# EAGLE schematic STM32-PROX (EAGLE 6.5.0)

## Sheet 1 of 8
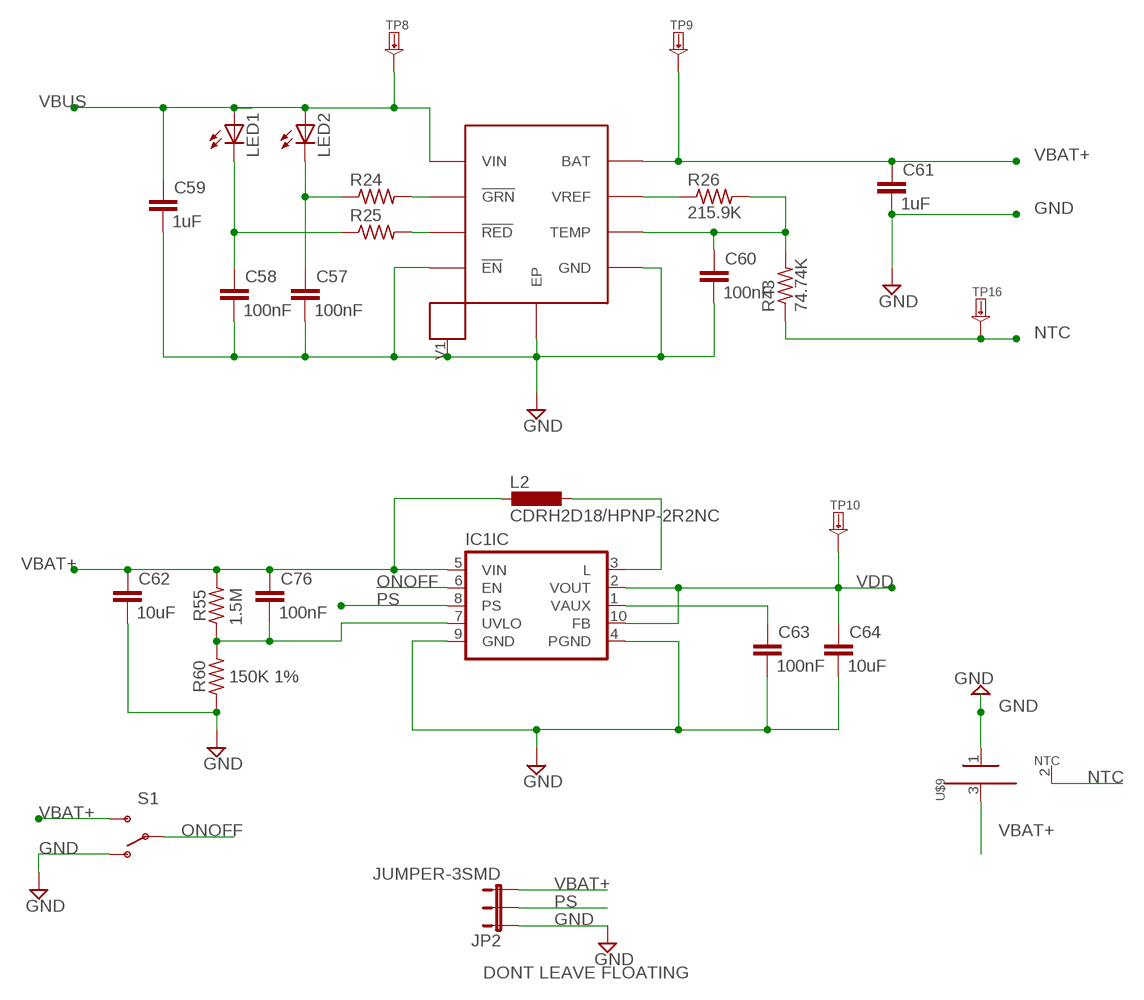
[diagram p0: schematic, sheet 1]

### Parts
C57  100nF  CAPACITORRLC_0603  [RLC_0603]
C58  100nF  CAPACITORRLC_0603  [RLC_0603]
C59  1uF  CAPACITORRLC_0603  [RLC_0603]
C60  100nF  CAPACITORRLC_0603  [RLC_0603]
C61  1uF  CAPACITORRLC_0603  [RLC_0603]
C62  10uF  CAPACITORRLC_0603  [RLC_0603]
C63  100nF  CAPACITORRLC_0603  [RLC_0603]
C64  10uF  CAPACITORRLC_0603  [RLC_0603]
C76  100nF  CAPACITORRLC_0603  [RLC_0603]
IC1  IC_TPS6120XQFN10  [QFN-10]
JP2  JUMPER-3SMD  [SJ_3]
L2  CDRH2D18/HPNP-2R2NC  CDRH2D18  [CDRH2D18]
LED1  LED_LEDSML0603  [LED_SML0603]
LED2  LED_LEDSML0603  [LED_SML0603]
R24  RESISTORRLC_0603  [RLC_0603@1]
R25  RESISTORRLC_0603  [RLC_0603@1]
R26  215.9K  RESISTORRLC_0603  [RLC_0603@1]
R43  74.74K  RESISTORRLC_0603  [RLC_0603@1]
R55  1.5M  RESISTORRLC_0603  [RLC_0603@1]
R60  150K 1%  RESISTORRLC_0603  [RLC_0603@1]
S1  SWITCH-SPDT-SMD-A  [SWITCH-SPST-SMD-A]
TP8  TESTPAD0.7MM-ROUND-DRILLED  [TESTPAD-PTH-0.7MM]
TP9  TESTPADKEYSTONE-SMD  --MERGED_TESTPADKEYSTONE-SMD  [--MERGED_KEYSTONE-SMD-TESTPOINT-5015]
TP10  TESTPADKEYSTONE-SMD  --MERGED_TESTPADKEYSTONE-SMD  [--MERGED_KEYSTONE-SMD-TESTPOINT-5015]
TP16  TESTPAD  [SMD-TESTPOINT]
U$7  MC34674  [UDFN-EP]
U$9  BATT  [BATT]

### Nets
GND [power]: C57.2 C58.2 C59.2 C60.2 C61.2 C62.2 C63.2 C64.2 IC1.4(IC:PGND) IC1.9(IC:GND) JP2.1 R60.1 S1.1(O) U$7.4(!EN) U$7.5(GND) U$7.9(EP) U$7.V1 U$9.1(NEG) ; also sheet 2,3,4,5,6,7,8
N$6: C57.1 LED2.C R24.1
N$8: R24.2 U$7.2(!GRN)
N$55: C58.1 LED1.C R25.1
N$63: R25.2 U$7.3(!RED)
N$64: R26.1 U$7.7(VREF)
N$65: C60.1 R26.2 R43.2 U$7.6(TEMP)
N$66: C63.1 IC1.1(IC:VAUX)
N$67: C76.2 IC1.7(IC:UVLO) R55.1 R60.2
N$68: IC1.3(IC:L) L2.P$2
NTC [power]: R43.1 TP16.1 U$9.2(NTC)
ONOFF: IC1.6(IC:EN) S1.2(P)
PS: IC1.8(IC:PS) JP2.2
VBAT+ [power]: C61.1 C62.1 C76.1 IC1.5(IC:VIN) JP2.3 L2.P$1 R55.2 S1.3(S) TP9.1 U$7.8(BAT) U$9.3(POS)
VBUS [power]: C59.1 LED1.A LED2.A TP8.1 U$7.1(VIN) ; also sheet 2
VDD [power]: C64.1 IC1.2(IC:VOUT) IC1.10(IC:FB) TP10.1 ; also sheet 2,4,5,6

### Notes on the sheet
- DONT LEAVE FLOATING

## Sheet 2 of 8
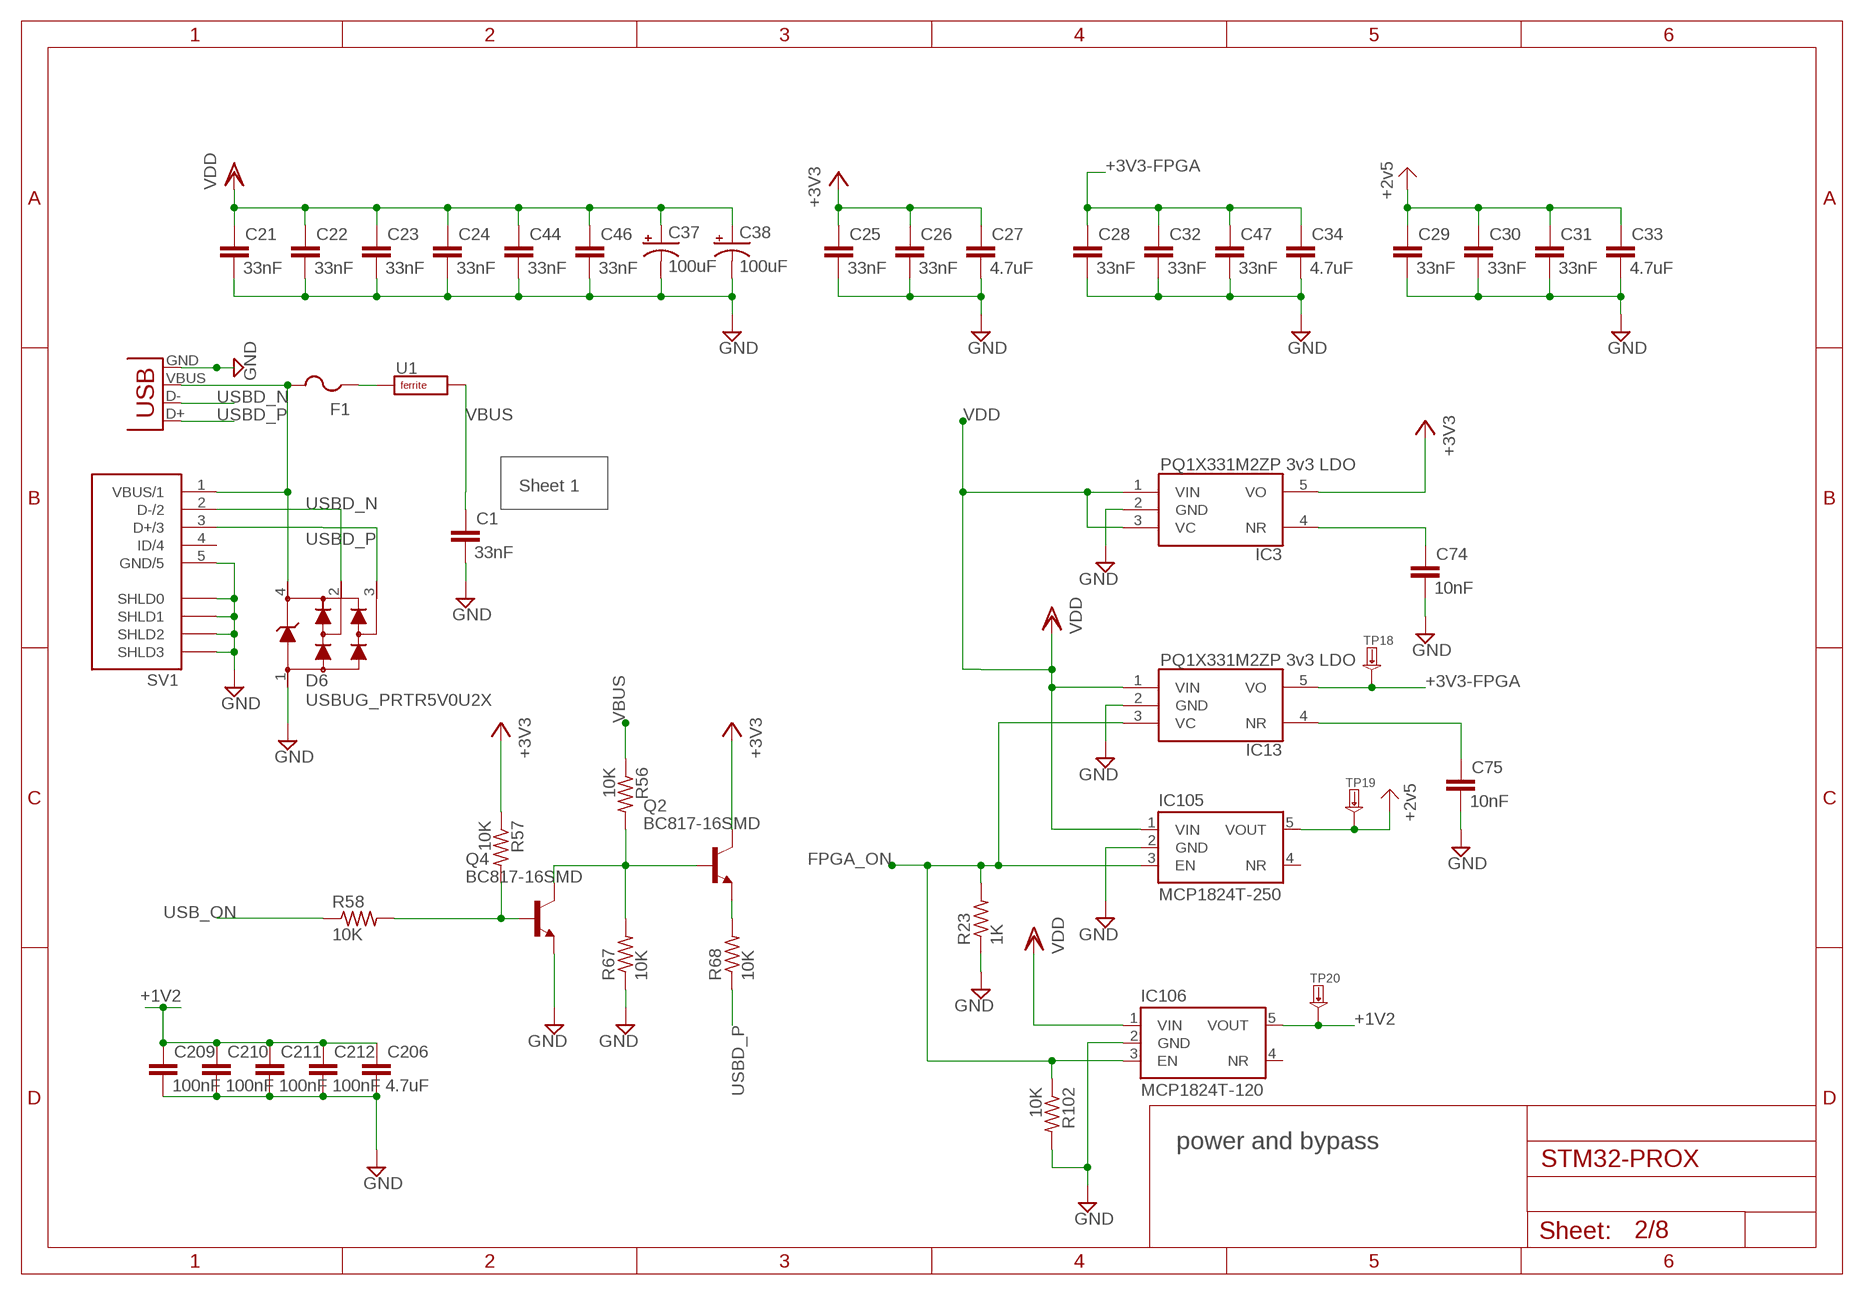
[diagram p1: schematic, sheet 2]

### Parts
C1  33nF  CAPACITORRLC_0603  [RLC_0603]
C21  33nF  CAPACITORRLC_0603  [RLC_0603]
C22  33nF  CAPACITORRLC_0603  [RLC_0603]
C23  33nF  CAPACITORRLC_0603  [RLC_0603]
C24  33nF  CAPACITORRLC_0603  [RLC_0603]
C25  33nF  CAPACITORRLC_0603  [RLC_0603]
C26  33nF  CAPACITORRLC_0603  [RLC_0603]
C27  4.7uF  CAPACITOR1210  [RLC_1210]
C28  33nF  CAPACITORRLC_0603  [RLC_0603]
C29  33nF  CAPACITORRLC_0603  [RLC_0603]
C30  33nF  CAPACITORRLC_0603  [RLC_0603]
C31  33nF  CAPACITORRLC_0603  [RLC_0603]
C32  33nF  CAPACITORRLC_0603  [RLC_0603]
C33  4.7uF  CAPACITOR1210  [RLC_1210]
C34  4.7uF  CAPACITOR1210  [RLC_1210]
C37  100uF  CPOL-USD/7343-31R  [D/7343-31R]
C38  100uF  CPOL-USD/7343-31R  [D/7343-31R]
C44  33nF  CAPACITORRLC_0603  [RLC_0603]
C46  33nF  CAPACITORRLC_0603  [RLC_0603]
C47  33nF  CAPACITORRLC_0603  [RLC_0603]
C74  10nF  CAPACITORRLC_0603  [RLC_0603]
C75  10nF  CAPACITORRLC_0603  [RLC_0603]
C206  4.7uF  CAPACITORRLC_0603  [RLC_0603]
C209  100nF  CAPACITORRLC_0603  [RLC_0603]
C210  100nF  CAPACITORRLC_0603  [RLC_0603]
C211  100nF  CAPACITORRLC_0603  [RLC_0603]
C212  100nF  CAPACITORRLC_0603  [RLC_0603]
D6  USBUG_PRTR5V0U2X  [USBUG_SOT143B]
F1  PTCFUSE-1812  [1812]
IC3  PQ1X331M2ZP-3V3-LDO-SOT-23-5  [SOT-23-5]
IC13  PQ1X331M2ZP-3V3-LDO-SOT-23-5  [SOT-23-5]
IC105  MCP1824T-250  TPS79925  [SOT-23-5]
IC106  MCP1824T-120  TPS79912  [SOT-23-5]
Q2  BC817-16SMD  [SOT23-BEC]
Q4  BC817-16SMD  [SOT23-BEC]
R23  1K  RESISTORRLC_0603  [RLC_0603@1]
R56  10K  RESISTORRLC_0603  [RLC_0603@1]
R57  10K  RESISTORRLC_0603  [RLC_0603@1]
R58  10K  RESISTORRLC_0603  [RLC_0603@1]
R67  10K  RESISTORRLC_0603  [RLC_0603@1]
R68  10K  RESISTORRLC_0603  [RLC_0603@1]
R102  10K  RESISTORRLC_0603  [RLC_0603@1]
SV1  USB-MINIB  [USB-MINIB-SMD]
TP18  TESTPAD  [SMD-TESTPOINT]
TP19  TESTPAD  [SMD-TESTPOINT]
TP20  TESTPAD  [SMD-TESTPOINT]
U1  FERRITE0805  [RLC_0805]
USB-MICRO  USB-MICROB  [USB-MICROB]

### Nets
+1V2 [power]: C206.1 C209.1 C210.1 C211.1 C212.1 IC106.5(VOUT) TP20.1 ; also sheet 4
+2V5 [power]: C29.1 C30.1 C31.1 C33.1 IC105.5(VOUT) TP19.1 ; supply symbol labelled SUPPLY_2V5 ; also sheet 4
+3V3 [power]: C25.1 C26.1 C27.1 IC3.5(VO) Q2.C R57.1 ; also sheet 3,4,7,8
+3V3-FPGA [power]: C28.1 C32.1 C34.1 C47.1 IC13.5(VO) TP18.1 ; also sheet 4
FPGA_ON: IC13.3(VC) IC105.3(EN) IC106.3(EN) R23.2 R102.1 ; also sheet 3
GND [power]: C1.2 C21.2 C22.2 C23.2 C24.2 C25.2 C26.2 C27.2 C28.2 C29.2 C30.2 C31.2 C32.2 C33.2 C34.2 C37.- C38.- C44.2 C46.2 C47.2 C74.2 C75.2 C206.2 C209.2 C210.2 C211.2 C212.2 D6.1 IC3.2(GND) IC13.2(GND) IC105.2(GND) IC106.2(GND) Q4.E R23.1 R67.1 R102.2 SV1.5(GND/5) SV1.TAB0(SHLD0) SV1.TAB1(SHLD1) SV1.TAB2(SHLD2) SV1.TAB3(SHLD3) USB-MICRO.GND ; also sheet 1,3,4,5,6,7,8
N$12 [power]: F1.1 U1.1(A)
N$46: C74.1 IC3.4(NR)
N$49: C75.1 IC13.4(NR)
N$70: Q2.E R68.2
N$71: Q4.B R57.2 R58.2
N$72: Q2.B Q4.C R56.2 R67.2
USB_ON: R58.1 ; also sheet 3
USBD_N: D6.2 SV1.2(D-/2) USB-MICRO.D- ; also sheet 3
USBD_P: D6.3 R68.1 SV1.3(D+/3) USB-MICRO.D+ ; also sheet 3
VBUS [power]: C1.1 R56.1 U1.2(B) ; also sheet 1
VBUS_IN [power]: D6.4 F1.2 SV1.1(VBUS/1) USB-MICRO.VBUS
VDD [power]: C21.1 C22.1 C23.1 C24.1 C37.+ C38.+ C44.1 C46.1 IC3.1(VIN) IC3.3(VC) IC13.1(VIN) IC105.1(VIN) IC106.1(VIN) ; also sheet 1,4,5,6
Unconnected: IC105.4(NR) IC106.4(NR) SV1.4(ID/4)

### Notes on the sheet
- Sheet 1
- power and bypass

## Sheet 3 of 8
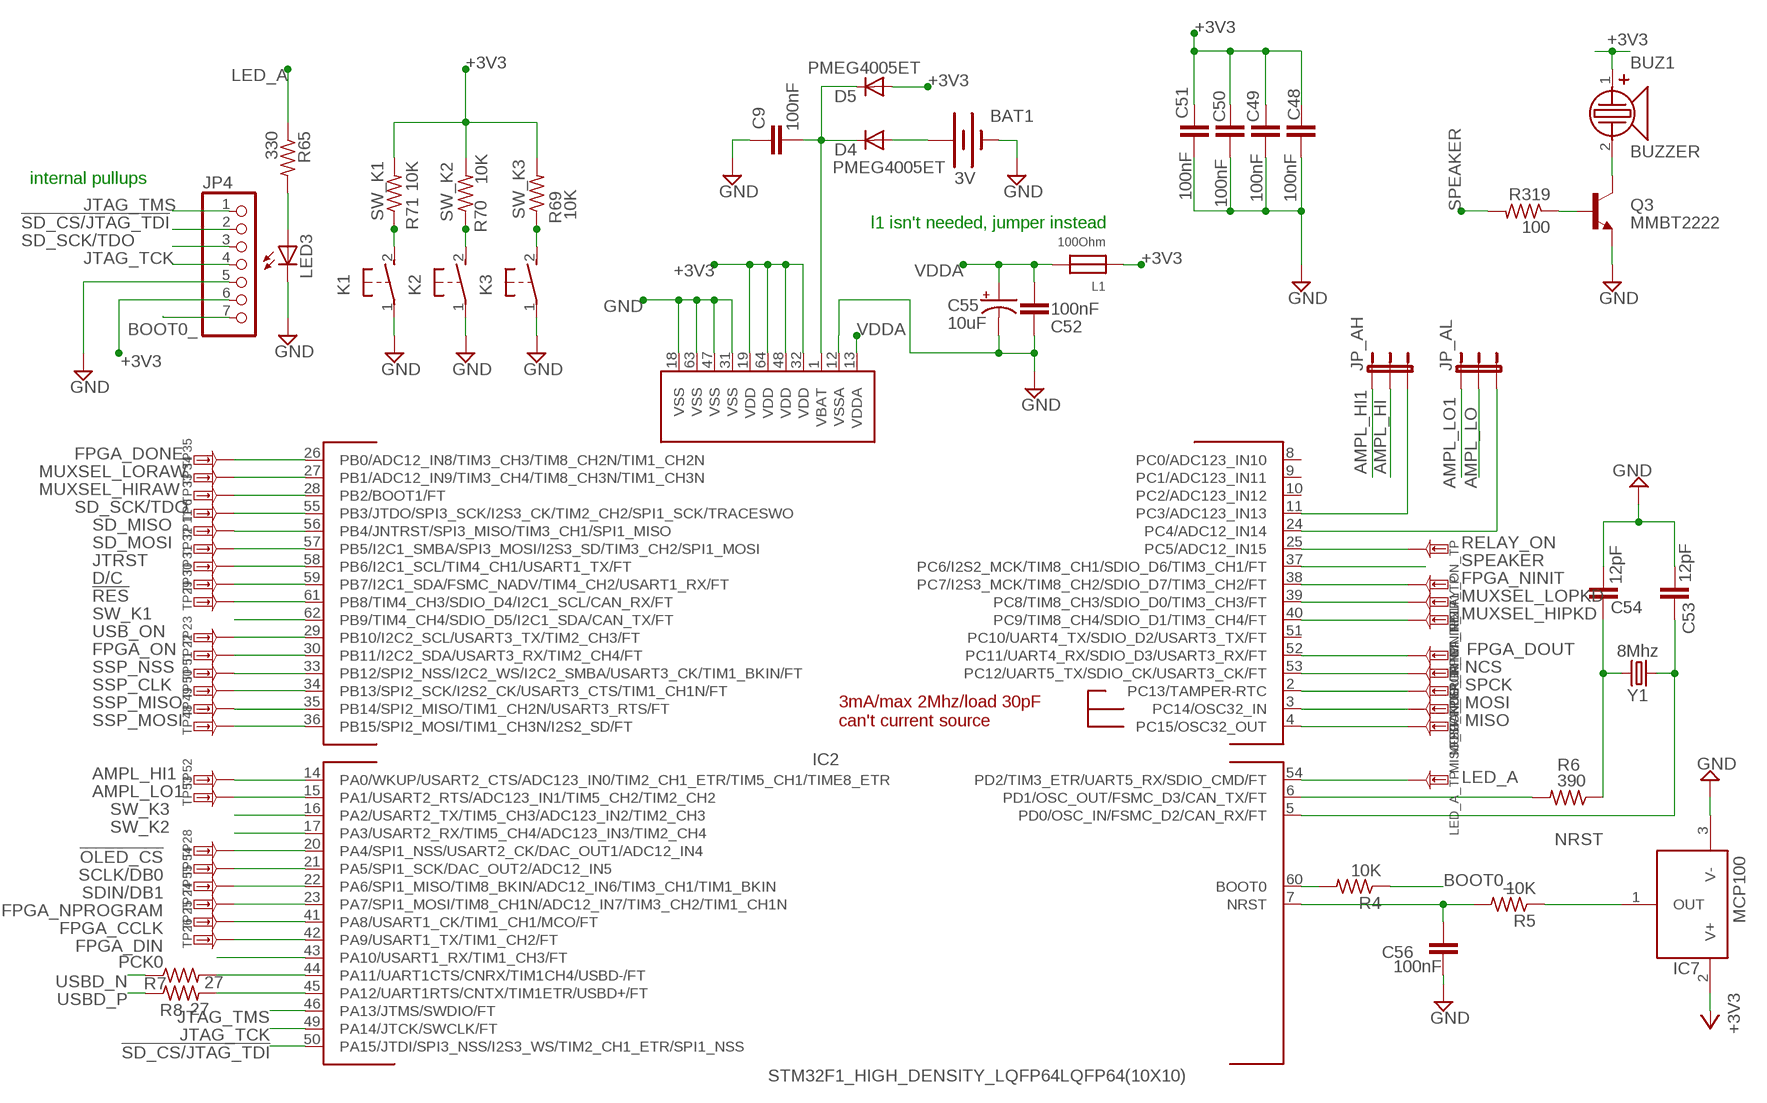
[diagram p2: schematic, sheet 3]

### Parts
BAT1  3V  NSL_SPARKFUN_BATTERY12MM  [NSL_SPARKFUN_BATTCON_12MM]
BUZ1  BUZZER  [BUZZER]
C9  100nF  CAPACITORRLC_0603  [RLC_0603]
C48  100nF  CAPACITORRLC_0603  [RLC_0603]
C49  100nF  CAPACITORRLC_0603  [RLC_0603]
C50  100nF  CAPACITORRLC_0603  [RLC_0603]
C51  100nF  CAPACITORRLC_0603  [RLC_0603]
C52  100nF  CAPACITORRLC_0603  [RLC_0603]
C53  12pF  CAPACITORRLC_0603  [RLC_0603]
C54  12pF  CAPACITORRLC_0603  [RLC_0603]
C55  10uF  CAP_POL1206-KIT  [EIA3216-KIT]
C56  100nF  CAPACITORRLC_0603  [RLC_0603]
D4  PMEG4005ET  DIODESOT23  [SOT23-3]
D5  PMEG4005ET  DIODESOT23  [SOT23-3]
FPGA_DOUT_TP  TESTPAD  [SMD-TESTPOINT]
FPGA_NINIT_TP  TESTPAD  [SMD-TESTPOINT]
FPGA_NINIT_TP1  TESTPAD  [SMD-TESTPOINT]
FPGA_NINIT_TP2  TESTPAD  [SMD-TESTPOINT]
IC2  STM32F1_HIGH_DENSITY_LQFP64LQFP64(10X10)  [LQFP64A_PACKAGE]
IC7  MCP100  [SOT23-3LEAD]
JP4  HEADER-1X7ROUND  [1X07_ROUND]
JP_AH  JUMPER-3SMD  [SJ_3]
JP_AL  JUMPER-3SMD  [SJ_3]
K1  5-XX  [B3F-5XX]
K2  5-XX  [B3F-5XX]
K3  5-XX  [B3F-5XX]
L1  100Ohm  FERRITE1  [0603]
LED3  LED_LEDSML0603  [LED_SML0603]
LED_A_TP  TESTPAD  [SMD-TESTPOINT]
MISO_TP  TESTPAD  [SMD-TESTPOINT]
MOSI_TP  TESTPAD  [SMD-TESTPOINT]
NCS_TP  TESTPAD  [SMD-TESTPOINT]
Q3  MMBT2222  TRANSISTOR_NPNSOT23  [SOT-23-3]
R4  10K  RESISTORRLC_0603  [RLC_0603@1]
R5  10K  RESISTORRLC_0603  [RLC_0603@1]
R6  390  RESISTORRLC_0603  [RLC_0603@1]
R7  27  RESISTORRLC_0603  [RLC_0603@1]
R8  27  RESISTORRLC_0603  [RLC_0603@1]
R65  330  RESISTORRLC_0603  [RLC_0603@1]
R69  10K  RESISTORRLC_0603  [RLC_0603@1]
R70  10K  RESISTORRLC_0603  [RLC_0603@1]
R71  10K  RESISTORRLC_0603  [RLC_0603@1]
R319  100  RESISTORRLC_0603  [RLC_0603@1]
RELAY_ON_TP  TESTPAD  [SMD-TESTPOINT]
SPCK_TP  TESTPAD  [SMD-TESTPOINT]
TP6  TESTPAD  [SMD-TESTPOINT]
TP11  TESTPAD  [SMD-TESTPOINT]
TP22  TESTPAD  [SMD-TESTPOINT]
TP23  TESTPAD  [SMD-TESTPOINT]
TP24  TESTPAD  [SMD-TESTPOINT]
TP25  TESTPAD  [SMD-TESTPOINT]
TP26  TESTPAD  [SMD-TESTPOINT]
TP28  TESTPAD  [SMD-TESTPOINT]
TP29  TESTPAD  [SMD-TESTPOINT]
TP30  TESTPAD  [SMD-TESTPOINT]
TP31  TESTPAD  [SMD-TESTPOINT]
TP32  TESTPAD  [SMD-TESTPOINT]
TP33  TESTPAD  [SMD-TESTPOINT]
TP34  TESTPAD  [SMD-TESTPOINT]
TP35  TESTPAD  [SMD-TESTPOINT]
TP48  TESTPAD  [SMD-TESTPOINT]
TP49  TESTPAD  [SMD-TESTPOINT]
TP50  TESTPAD  [SMD-TESTPOINT]
TP51  TESTPAD  [SMD-TESTPOINT]
TP52  TESTPAD  [SMD-TESTPOINT]
TP53  TESTPAD  [SMD-TESTPOINT]
TP54  TESTPAD  [SMD-TESTPOINT]
TP55  TESTPAD  [SMD-TESTPOINT]
Y1  8Mhz  CRYSTALTXC-7A  [CRYSTAL-TXC-7A]

### Nets
!OLED_CS: IC2.20(PA4/SPI1_NSS/USART2_CK/DAC_OUT1/ADC12_IN4) TP28.1 ; also sheet 7
!RES: IC2.61(PB8/TIM4_CH3/SDIO_D4/I2C1_SCL/CAN_RX/FT) TP29.1 ; also sheet 7
!SD_CS/JTAG_TDI: IC2.50(PA15/JTDI/SPI3_NSS/I2S3_WS/TIM2_CH1_ETR/SPI1_NSS) JP4.2 ; also sheet 8
+3V3 [power]: BUZ1.1 C48.1 C49.1 C50.1 C51.1 D5.1(A) IC2.19(VDD) IC2.32(VDD) IC2.48(VDD) IC2.64(VDD) IC7.2(V+) JP4.6 L1.1 R69.2 R70.2 R71.2 ; also sheet 2,4,7,8
AMPL_HI: JP_AH.2 ; also sheet 5
AMPL_HI1: IC2.14(PA0/WKUP/USART2_CTS/ADC123_IN0/TIM2_CH1_ETR/TIM5_CH1/TIME8_ETR) JP_AH.1 TP52.1
AMPL_LO: JP_AL.2 ; also sheet 5
AMPL_LO1: IC2.15(PA1/USART2_RTS/ADC123_IN1/TIM5_CH2/TIM2_CH2) JP_AL.1 TP53.1
BOOT0: IC2.60(BOOT0) R4.2
BOOT0_: JP4.7 R4.1
D/C: IC2.59(PB7/I2C1_SDA/FSMC_NADV/TIM4_CH2/USART1_RX/FT) TP30.1 ; also sheet 7
D_N: IC2.44(PA11/UART1CTS/CNRX/TIM1CH4/USBD-/FT) R7.2
D_P: IC2.45(PA12/UART1RTS/CNTX/TIM1ETR/USBD+/FT) R8.2
FPGA_CCLK: IC2.41(PA8/USART1_CK/TIM1_CH1/MCO/FT) TP25.1 ; also sheet 4
FPGA_DIN: IC2.42(PA9/USART1_TX/TIM1_CH2/FT) TP26.1 ; also sheet 4
FPGA_DONE: IC2.26(PB0/ADC12_IN8/TIM3_CH3/TIM8_CH2N/TIM1_CH2N) TP35.1 ; also sheet 4
FPGA_DOUT: FPGA_DOUT_TP.1 IC2.52(PC11/UART4_RX/SDIO_D3/USART3_RX/FT) ; also sheet 4
FPGA_NINIT: FPGA_NINIT_TP.1 IC2.38(PC7/I2S3_MCK/TIM8_CH2/SDIO_D7/TIM3_CH2/FT) ; also sheet 4
FPGA_NPROGRAM: IC2.23(PA7/SPI1_MOSI/TIM8_CH1N/ADC12_IN7/TIM3_CH2/TIM1_CH1N) TP24.1 ; also sheet 4
FPGA_ON: IC2.30(PB11/I2C2_SDA/USART3_RX/TIM2_CH4/FT) TP22.1 ; also sheet 2
GND [power]: BAT1.GND(-) C9.1 C48.2 C49.2 C50.2 C51.2 C52.2 C53.1 C54.1 C55.C(-) C56.2 IC2.12(VSSA) IC2.18(VSS) IC2.31(VSS) IC2.47(VSS) IC2.63(VSS) IC7.3(V-) JP4.5 K1.1(P) K2.1(P) K3.1(P) LED3.C Q3.2(E) ; also sheet 1,2,4,5,6,7,8
JTAG_TCK: IC2.49(PA14/JTCK/SWCLK/FT) JP4.4
JTAG_TMS: IC2.46(PA13/JTMS/SWDIO/FT) JP4.1
JTRST: IC2.58(PB6/I2C1_SCL/TIM4_CH1/USART1_TX/FT) TP31.1
LED3: LED3.A R65.2
LED_A: IC2.54(PD2/TIM3_ETR/UART5_RX/SDIO_CMD/FT) LED_A_TP.1 R65.1
MISO: IC2.4(PC15/OSC32_OUT) MISO_TP.1 ; also sheet 4
MOSI: IC2.3(PC14/OSC32_IN) MOSI_TP.1 ; also sheet 4
MUXSEL_HIPKD: FPGA_NINIT_TP2.1 IC2.40(PC9/TIM8_CH4/SDIO_D1/TIM3_CH4/FT) ; also sheet 5
MUXSEL_HIRAW: IC2.28(PB2/BOOT1/FT) TP33.1 ; also sheet 5
MUXSEL_LOPKD: FPGA_NINIT_TP1.1 IC2.39(PC8/TIM8_CH3/SDIO_D0/TIM3_CH3/FT) ; also sheet 5
MUXSEL_LORAW: IC2.27(PB1/ADC12_IN9/TIM3_CH4/TIM8_CH3N/TIM1_CH3N) TP34.1 ; also sheet 5
N$1: IC2.24(PC4/ADC12_IN14) JP_AL.3
N$2: C53.2 IC2.5(PD0/OSC_IN/FSMC_D2/CAN_RX/FT) Y1.P$1
N$7: IC2.11(PC3/ADC123_IN13) JP_AH.3
N$30: C9.2 D4.3(C) D5.3(C) IC2.1(VBAT)
N$57: BAT1.PWR@1(+) D4.1(A)
N$59: BUZ1.2 Q3.3(C)
N$60: Q3.1(B) R319.1
N$61: IC2.6(PD1/OSC_OUT/FSMC_D3/CAN_TX/FT) R6.2
N$62: C54.2 R6.1 Y1.P$2
N$69: IC7.1(OUT) R5.1
NCS: IC2.53(PC12/UART5_TX/SDIO_CK/USART3_CK/FT) NCS_TP.1 ; also sheet 4
NRST: C56.1 IC2.7(NRST) R5.2
PCK0: IC2.43(PA10/USART1_RX/TIM1_CH3/FT) ; also sheet 4
RELAY_ON: IC2.25(PC5/ADC12_IN15) RELAY_ON_TP.1 ; also sheet 5
SCLK/DB0: IC2.21(PA5/SPI1_SCK/DAC_OUT2/ADC12_IN5) TP54.1 ; also sheet 7
SD_MISO: IC2.56(PB4/JNTRST/SPI3_MISO/TIM3_CH1/SPI1_MISO) TP11.1 ; also sheet 8
SD_MOSI: IC2.57(PB5/I2C1_SMBA/SPI3_MOSI/I2S3_SD/TIM3_CH2/SPI1_MOSI) TP32.1 ; also sheet 8
SD_SCK/TDO: IC2.55(PB3/JTDO/SPI3_SCK/I2S3_CK/TIM2_CH2/SPI1_SCK/TRACESWO) JP4.3 TP6.1 ; also sheet 8
SDIN/DB1: IC2.22(PA6/SPI1_MISO/TIM8_BKIN/ADC12_IN6/TIM3_CH1/TIM1_BKIN) TP55.1 ; also sheet 7
SPCK: IC2.2(PC13/TAMPER-RTC) SPCK_TP.1 ; also sheet 4
SPEAKER: IC2.37(PC6/I2S2_MCK/TIM8_CH1/SDIO_D6/TIM3_CH1/FT) R319.2
SSP_CLK: IC2.34(PB13/SPI2_SCK/I2S2_CK/USART3_CTS/TIM1_CH1N/FT) TP50.1 ; also sheet 4
SSP_MISO: IC2.35(PB14/SPI2_MISO/TIM1_CH2N/USART3_RTS/FT) TP49.1 ; also sheet 4
SSP_MOSI: IC2.36(PB15/SPI2_MOSI/TIM1_CH3N/I2S2_SD/FT) TP48.1 ; also sheet 4
SSP_NSS: IC2.33(PB12/SPI2_NSS/I2C2_WS/I2C2_SMBA/USART3_CK/TIM1_BKIN/FT) TP51.1 ; also sheet 4
SW_K1: IC2.62(PB9/TIM4_CH4/SDIO_D5/I2C1_SDA/CAN_TX/FT) K1.2(S) R71.1
SW_K2: IC2.17(PA3/USART2_RX/TIM5_CH4/ADC123_IN3/TIM2_CH4) K2.2(S) R70.1
SW_K3: IC2.16(PA2/USART2_TX/TIM5_CH3/ADC123_IN2/TIM2_CH3) K3.2(S) R69.1
USB_ON: IC2.29(PB10/I2C2_SCL/USART3_TX/TIM2_CH3/FT) TP23.1 ; also sheet 2
USBD_N: R7.1 ; also sheet 2
USBD_P: R8.1 ; also sheet 2
VDDA: C52.1 C55.A(+) IC2.13(VDDA) L1.2
Unconnected: IC2.8(PC0/ADC123_IN10) IC2.9(PC1/ADC123_IN11) IC2.10(PC2/ADC123_IN12) IC2.51(PC10/UART4_TX/SDIO_D2/USART3_TX/FT)

### Notes on the sheet
- internal pullups
- l1 isn't needed, jumper instead

## Sheet 4 of 8
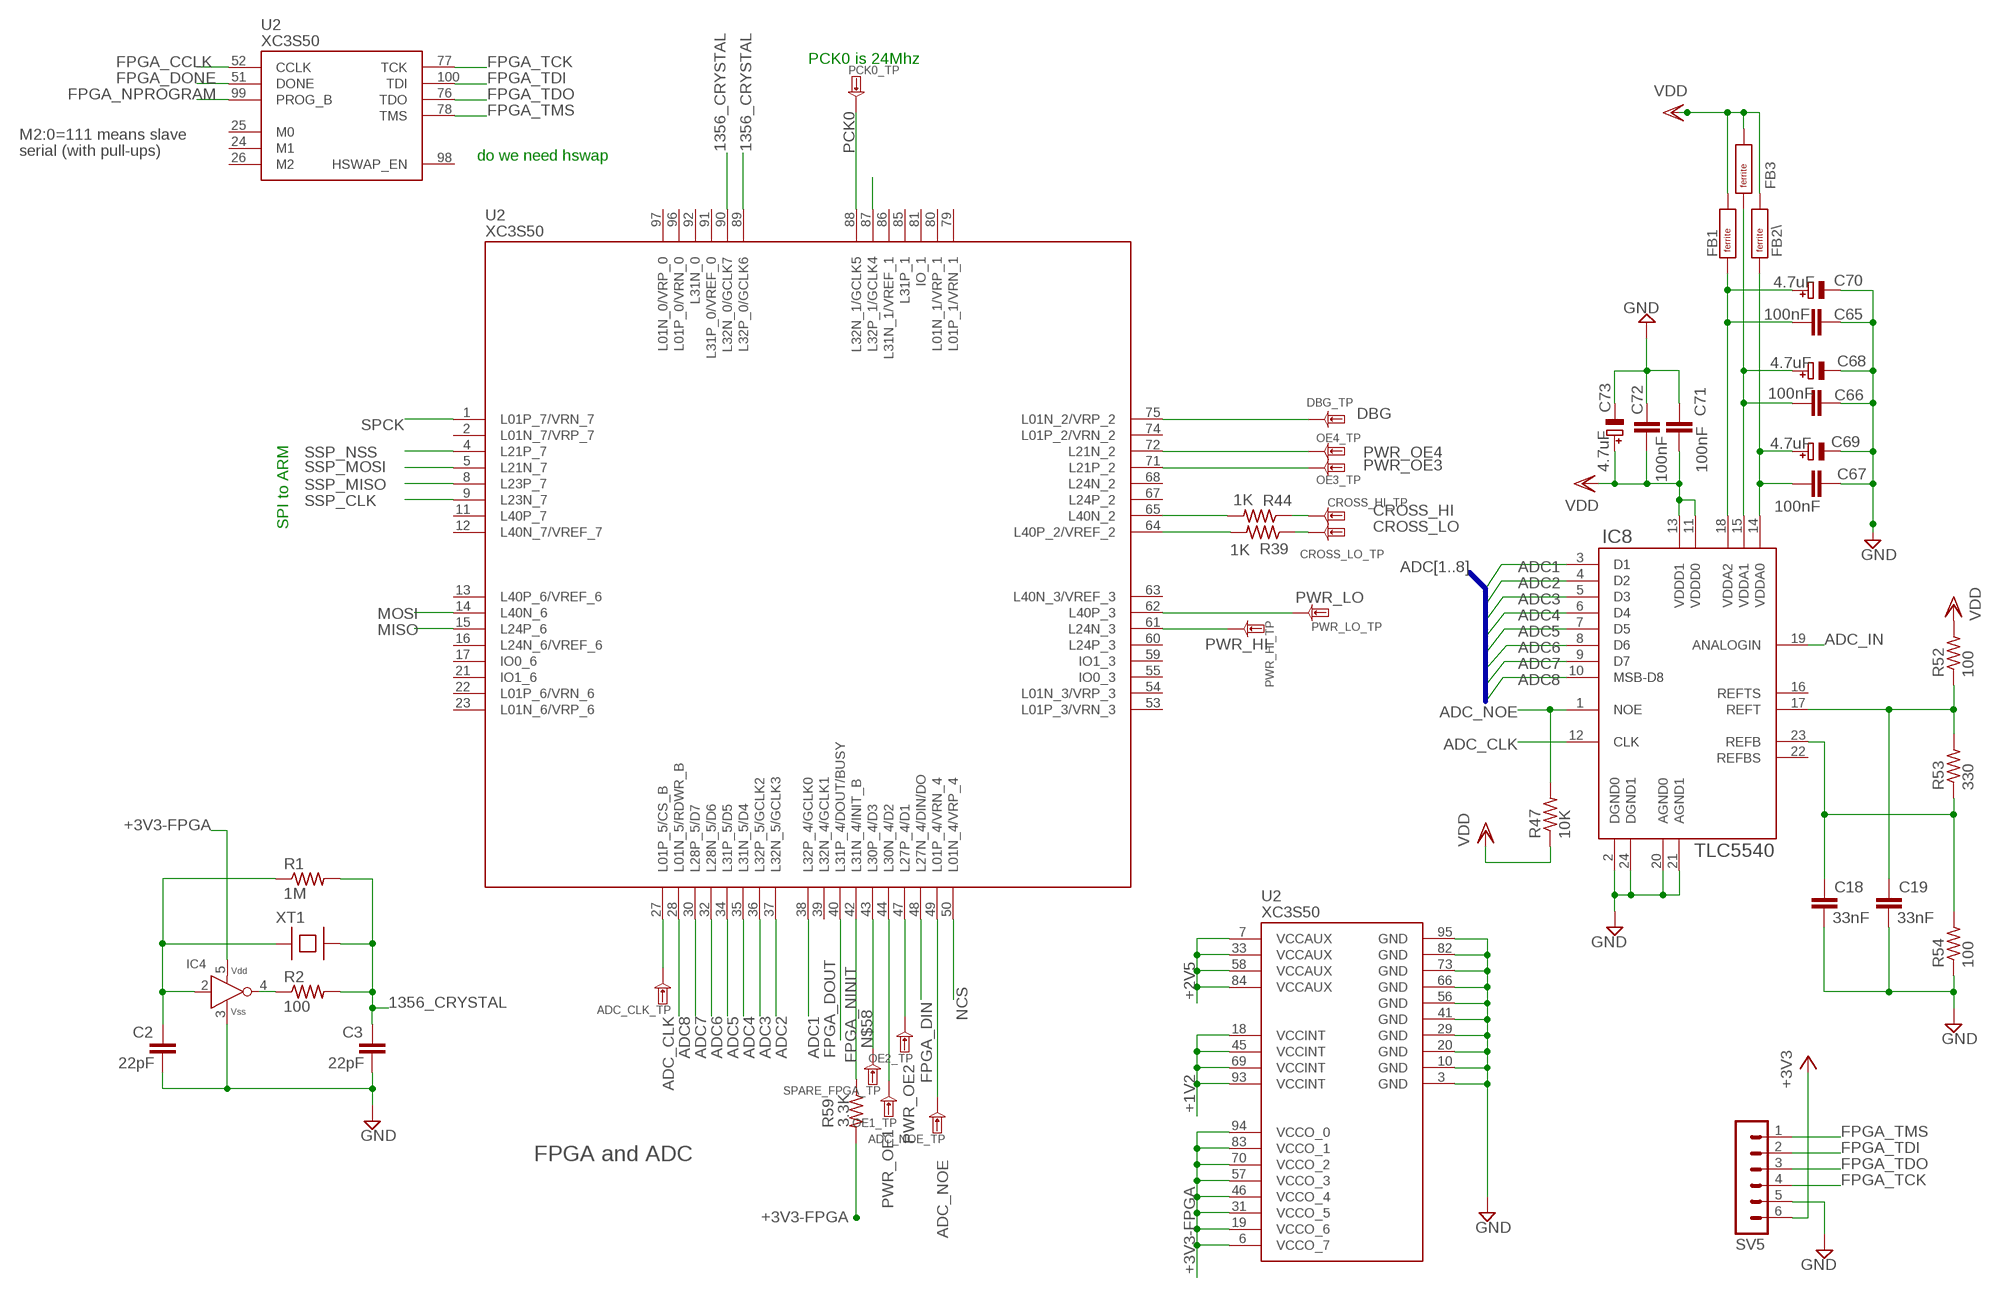
[diagram p3: schematic, sheet 4]

### Parts
ADC_CLK_TP  TESTPAD  [SMD-TESTPOINT]
ADC_NOE_TP  TESTPAD  [SMD-TESTPOINT]
C2  22pF  CAPACITORRLC_0603  [RLC_0603]
C3  22pF  CAPACITORRLC_0603  [RLC_0603]
C18  33nF  CAPACITORRLC_0603  [RLC_0603]
C19  33nF  CAPACITORRLC_0603  [RLC_0603]
C65  100nF  CAPACITORRLC_0603  [RLC_0603]
C66  100nF  CAPACITORRLC_0603  [RLC_0603]
C67  100nF  CAPACITORRLC_0603  [RLC_0603]
C68  4.7uF  CAP_TANTALUMA/3216_REFLOW  [EIA3216-18/A-R]
C69  4.7uF  CAP_TANTALUMA/3216_REFLOW  [EIA3216-18/A-R]
C70  4.7uF  CAP_TANTALUMA/3216_REFLOW  [EIA3216-18/A-R]
C71  100nF  CAPACITORRLC_0603  [RLC_0603]
C72  100nF  CAPACITORRLC_0603  [RLC_0603]
C73  4.7uF  CAP_TANTALUMA/3216_REFLOW  [EIA3216-18/A-R]
CROSS_HI_TP  TESTPAD  [SMD-TESTPOINT]
CROSS_LO_TP  TESTPAD  [SMD-TESTPOINT]
DBG_TP  TESTPAD  [SMD-TESTPOINT]
FB1  FERRITERLC_0603  [RLC_0603@1]
FB2\  FERRITERLC_0603  [RLC_0603@1]
FB3  FERRITERLC_0603  [RLC_0603@1]
IC4  HCU-INVERTER  [SMV-5]
IC8  TLC5540  [TSSOP-24]
OE1_TP  TESTPAD  [SMD-TESTPOINT]
OE2_TP  TESTPAD  [SMD-TESTPOINT]
OE3_TP  TESTPAD  [SMD-TESTPOINT]
OE4_TP  TESTPAD  [SMD-TESTPOINT]
PCK0_TP  TESTPAD  [SMD-TESTPOINT]
PWR_HI_TP  TESTPAD  [SMD-TESTPOINT]
PWR_LO_TP  TESTPAD  [SMD-TESTPOINT]
R1  1M  RESISTORRLC_0603  [RLC_0603@1]
R2  100  RESISTORRLC_0603  [RLC_0603@1]
R39  1K  RESISTORRLC_0603  [RLC_0603@1]
R44  1K  RESISTORRLC_0603  [RLC_0603@1]
R47  10K  RESISTORRLC_0603  [RLC_0603@1]
R52  100  RESISTORRLC_0603  [RLC_0603@1]
R53  330  RESISTORRLC_0603  [RLC_0603@1]
R54  100  RESISTORRLC_0603  [RLC_0603@1]
R59  3.3K  RESISTORRLC_0603  [RLC_0603@1]
SPARE_FPGA_TP  TESTPAD  [SMD-TESTPOINT]
SV5  HEADER-MALE-6X1  [HEADER-MALE-6X1-0.100-UNKEYED]
U2  XC3S50  [VQ100]
XT1  XTAL-SMD-CITIZEN-CS10  [XTAL-SMD-CITIZEN-CS10]

### Nets
1356_CRYSTAL: C3.1 R1.2 R2.2 U2.89(L32P_0/GCLK6) U2.90(L32N_0/GCLK7) XT1.B
+1V2 [power]: U2.18(VCCINT) U2.45(VCCINT) U2.69(VCCINT) U2.93(VCCINT) ; also sheet 2
+2V5 [power]: U2.7(VCCAUX) U2.33(VCCAUX) U2.58(VCCAUX) U2.84(VCCAUX) ; also sheet 2
+3V3 [power]: SV5.6 ; also sheet 2,3,7,8
+3V3-FPGA [power]: IC4.5(VDD) R59.2 U2.6(VCCO_7) U2.19(VCCO_6) U2.31(VCCO_5) U2.46(VCCO_4) U2.57(VCCO_3) U2.70(VCCO_2) U2.83(VCCO_1) U2.94(VCCO_0) ; also sheet 2
ADC1 [adc]: IC8.3(D1) U2.38(L32P_4/GCLK0)
ADC2 [adc]: IC8.4(D2) U2.37(L32N_5/GCLK3)
ADC3 [adc]: IC8.5(D3) U2.36(L32P_5/GCLK2)
ADC4 [adc]: IC8.6(D4) U2.35(L31N_5/D4)
ADC5 [adc]: IC8.7(D5) U2.34(L31P_5/D5)
ADC6 [adc]: IC8.8(D6) U2.32(L28N_5/D6)
ADC7 [adc]: IC8.9(D7) U2.30(L28P_5/D7)
ADC8 [adc]: IC8.10(MSB-D8) U2.28(L01N_5/RDWR_B)
ADC_CLK [adc]: ADC_CLK_TP.1 IC8.12(CLK) U2.27(L01P_5/CS_B)
ADC_IN: IC8.19(ANALOGIN) ; also sheet 5
ADC_NOE: ADC_NOE_TP.1 IC8.1(NOE) R47.2 U2.49(L01P_4/VRN_4)
CROSS_HI: CROSS_HI_TP.1 R44.1 ; also sheet 5
CROSS_LO: CROSS_LO_TP.1 R39.1 ; also sheet 5
DBG: DBG_TP.1 U2.75(L01N_2/VRP_2)
FPGA_CCLK: U2.52(CCLK) ; also sheet 3
FPGA_DIN: U2.48(L27N_4/DIN/DO) ; also sheet 3
FPGA_DONE: U2.51(DONE) ; also sheet 3
FPGA_DOUT: U2.40(L31P_4/DOUT/BUSY) ; also sheet 3
FPGA_NINIT: R59.1 U2.42(L31N_4/INIT_B) ; also sheet 3
FPGA_NPROGRAM: U2.99(PROG_B) ; also sheet 3
FPGA_TCK: SV5.4 U2.77(TCK)
FPGA_TDI: SV5.2 U2.100(TDI)
FPGA_TDO: SV5.3 U2.76(TDO)
FPGA_TMS: SV5.1 U2.78(TMS)
GND [power]: C2.2 C3.2 C18.2 C19.2 C65.2 C66.2 C67.2 C68.- C69.- C70.- C71.2 C72.2 C73.- IC4.3(VSS) IC8.2(DGND0) IC8.20(AGND0) IC8.21(AGND1) IC8.24(DGND1) R54.1 SV5.5 U2.3(GND) U2.10(GND) U2.20(GND) U2.29(GND) U2.41(GND) U2.56(GND) U2.66(GND) U2.73(GND) U2.82(GND) U2.95(GND) ; also sheet 1,2,3,5,6,7,8
MISO: U2.15(L24P_6) ; also sheet 3
MOSI: U2.14(L40N_6) ; also sheet 3
N$3: IC4.4(Y) R2.1
N$4: C2.1 IC4.2(A) R1.1 XT1.A
N$24: C18.1 IC8.23(REFB) R53.1 R54.2
N$27: R39.2 U2.64(L40P_2/VREF_2)
N$29: U2.87(L32P_1/GCLK4)
N$36: C67.1 C69.+ FB2\.1(A) IC8.14(VDDA0)
N$37: C66.1 C68.+ FB3.1(A) IC8.15(VDDA1)
N$39: C65.1 C70.+ FB1.1(A) IC8.18(VDDA2)
N$40: R44.2 U2.65(L40N_2)
N$48: C19.1 IC8.17(REFT) R52.1 R53.2
N$58: SPARE_FPGA_TP.1 U2.43(L30P_4/D3)
NCS: U2.50(L01N_4/VRP_4) ; also sheet 3
PCK0: PCK0_TP.1 U2.88(L32N_1/GCLK5) ; also sheet 3
PWR_HI: PWR_HI_TP.1 U2.61(L24N_3) ; also sheet 6
PWR_LO: PWR_LO_TP.1 U2.62(L40P_3) ; also sheet 6
PWR_OE1: OE1_TP.1 U2.44(L30N_4/D2) ; also sheet 6
PWR_OE2: OE2_TP.1 U2.47(L27P_4/D1) ; also sheet 6
PWR_OE3: OE3_TP.1 U2.71(L21P_2) ; also sheet 6
PWR_OE4: OE4_TP.1 U2.72(L21N_2) ; also sheet 6
SPCK: U2.1(L01P_7/VRN_7) ; also sheet 3
SSP_CLK: U2.9(L23N_7) ; also sheet 3
SSP_MISO: U2.8(L23P_7) ; also sheet 3
SSP_MOSI: U2.5(L21N_7) ; also sheet 3
SSP_NSS: U2.4(L21P_7) ; also sheet 3
VDD [power]: C71.1 C72.1 C73.+ FB1.2(B) FB2\.2(B) FB3.2(B) IC8.11(VDDD0) IC8.13(VDDD1) R47.1 R52.2 ; also sheet 1,2,5,6
Unconnected: IC8.16(REFTS) IC8.22(REFBS) U2.2(L01N_7/VRP_7) U2.11(L40P_7) U2.12(L40N_7/VREF_7) U2.13(L40P_6/VREF_6) U2.16(L24N_6/VREF_6) U2.17(IO0_6) U2.21(IO1_6) U2.22(L01P_6/VRN_6) U2.23(L01N_6/VRP_6) U2.24(M1) U2.25(M0) U2.26(M2) U2.39(L32N_4/GCLK1) U2.53(L01P_3/VRN_3) U2.54(L01N_3/VRP_3) U2.55(IO0_3) U2.59(IO1_3) U2.60(L24P_3) U2.63(L40N_3/VREF_3) U2.67(L24P_2) U2.68(L24N_2) U2.74(L01P_2/VRN_2) U2.79(L01P_1/VRN_1) U2.80(L01N_1/VRP_1) U2.81(IO_1) U2.85(L31P_1) U2.86(L31N_1/VREF_1) U2.91(L31P_0/VREF_0) U2.92(L31N_0) U2.96(L01P_0/VRN_0) U2.97(L01N_0/VRP_0) U2.98(HSWAP_EN)

### Buses
ADC[1..8]

### Notes on the sheet
- PCK0 is 24Mhz
- M2:0=111 means slave
- serial (with pull-ups)
- do we need hswap
- SPI to ARM
- FPGA and ADC

## Sheet 5 of 8
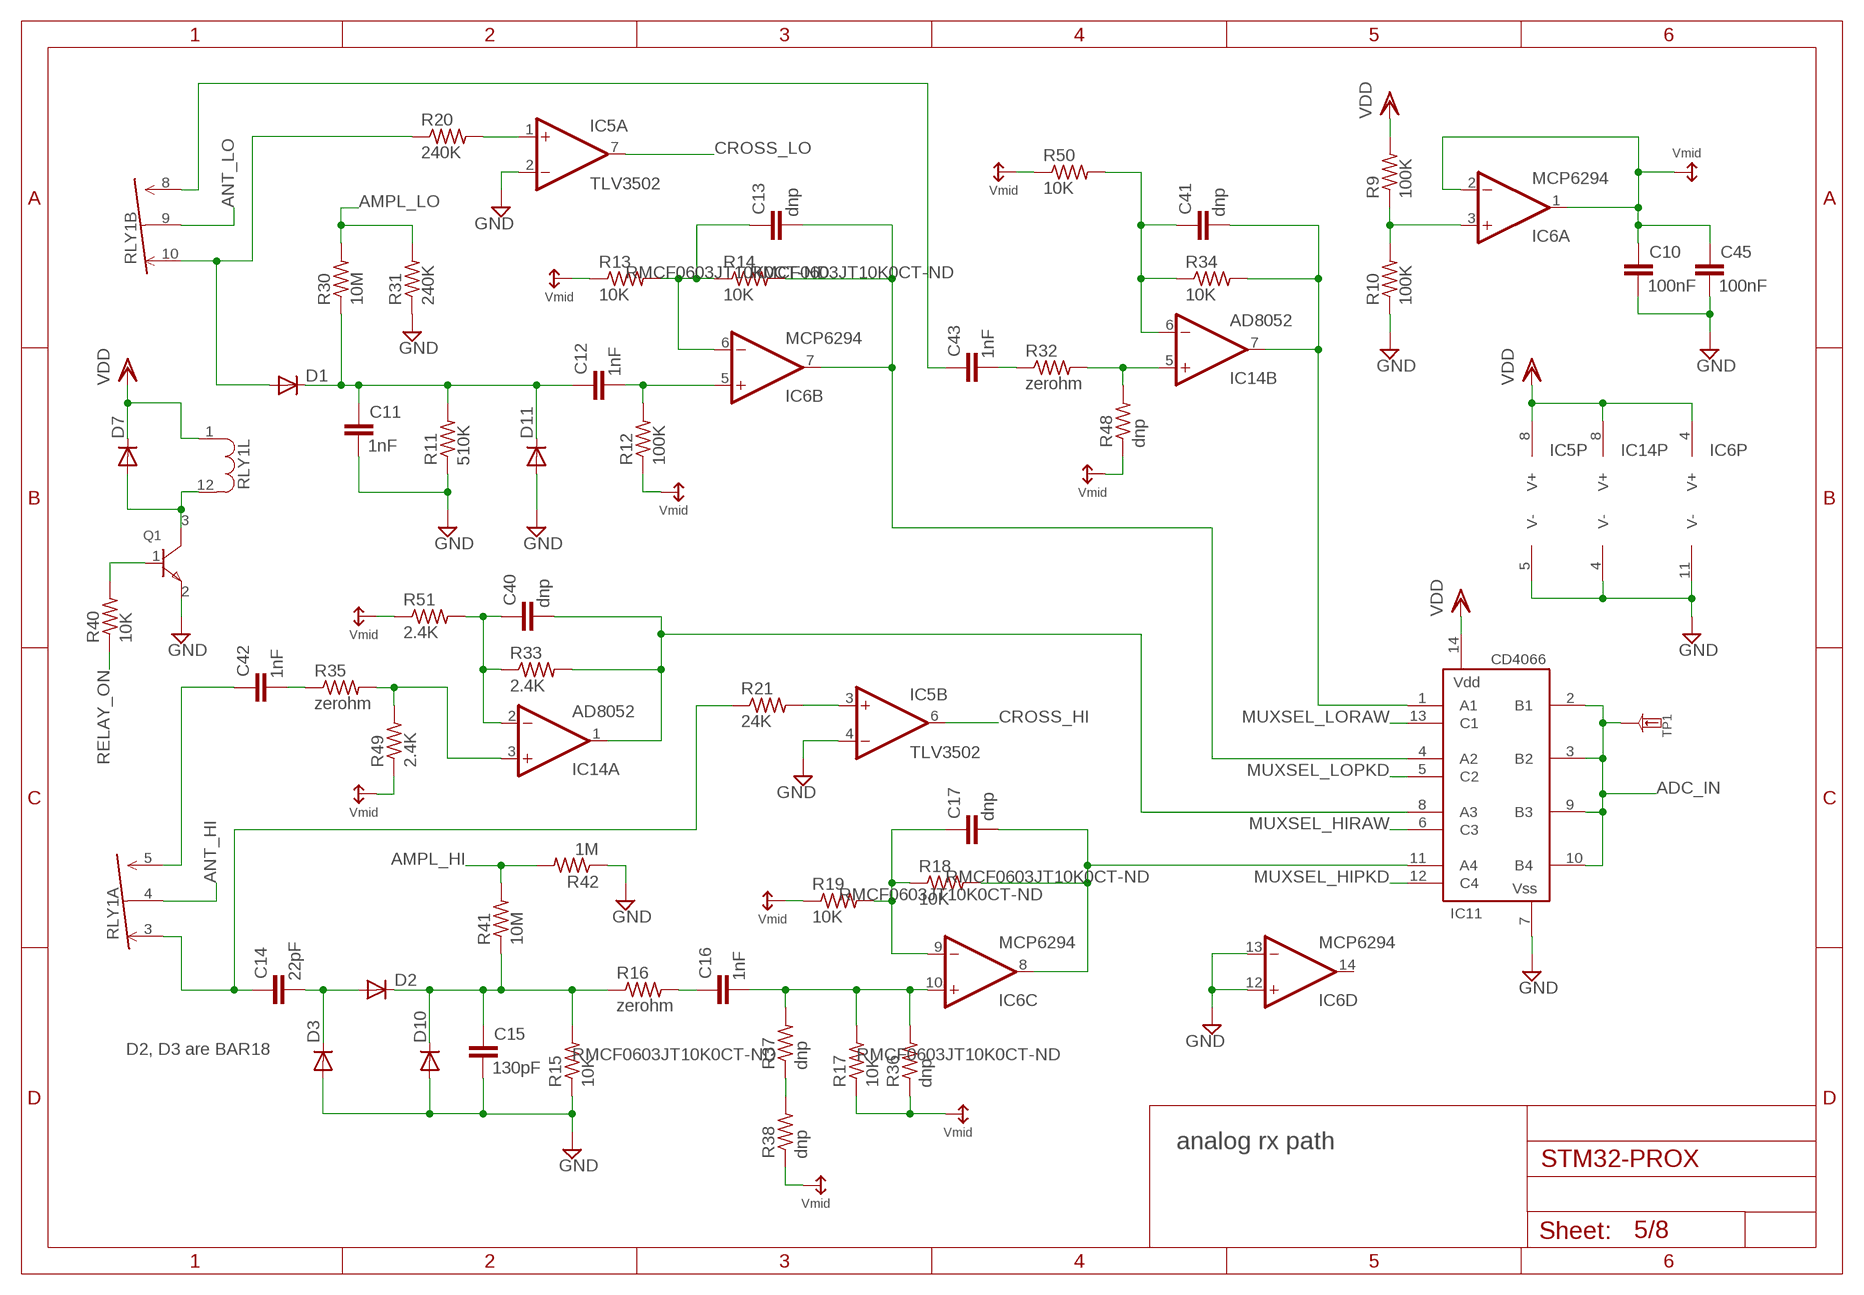
[diagram p4: schematic, sheet 5]

### Parts
C10  100nF  CAPACITORRLC_0603  [RLC_0603]
C11  1nF  CAPACITORRLC_0603  [RLC_0603]
C12  1nF  CAPACITORRLC_0603  [RLC_0603]
C13  dnp  CAPACITORRLC_0603  [RLC_0603]
C14  22pF  CAPACITORRLC_0603  [RLC_0603]
C15  130pF  CAPACITORRLC_0603  [RLC_0603]
C16  1nF  CAPACITORRLC_0603  [RLC_0603]
C17  dnp  CAPACITORRLC_0603  [RLC_0603]
C40  dnp  CAPACITORRLC_0603  [RLC_0603]
C41  dnp  CAPACITORRLC_0603  [RLC_0603]
C42  1nF  CAPACITORRLC_0603  [RLC_0603]
C43  1nF  CAPACITORRLC_0603  [RLC_0603]
C45  100nF  CAPACITORRLC_0603  [RLC_0603]
D1  DIODE-SMD-SOT23  [SOT23-3LEAD]
D2  DIODE-SMD-SOT23  [SOT23-3LEAD]
D3  DIODE-SMD-SOT23  [SOT23-3LEAD]
D7  DIODE-SMD-SOT23  [SOT23-3LEAD]
D10  DIODE-SMD-SOT23  [SOT23-3LEAD]
D11  DIODE-SMD-SOT23  [SOT23-3LEAD]
IC5  TLV3502  COMP-TLV3502SOT-23-8-OR-MSOP-8  [SOT-23-8-OR-MSOP-8]
IC6  MCP6294  OPAMP-TLC2274  [TSSOP-14]
IC11  CD4066  [TSSOP-14]
IC14  AD8052  OPAMP-AD8052  [MSOP8]
Q1  NPN-SOT23-2N3904  [SOT23-3LEAD]
R9  100K  RESISTORRLC_0603  [RLC_0603@1]
R10  100K  RESISTORRLC_0603  [RLC_0603@1]
R11  510K  RESISTORRLC_0603  [RLC_0603@1]
R12  100K  RESISTORRLC_0603  [RLC_0603@1]
R13  10K  RESISTORRLC_0603  [RLC_0603@1]
R14  10K  RESISTORRLC_0603  [RLC_0603@1]
R15  10K  RESISTORRLC_0603  [RLC_0603@1]
R16  zerohm  RESISTORRLC_0603  [RLC_0603@1]
R17  10K  RESISTORRLC_0603  [RLC_0603@1]
R18  10K  RESISTORRLC_0603  [RLC_0603@1]
R19  10K  RESISTORRLC_0603  [RLC_0603@1]
R20  240K  RESISTORRLC_0603  [RLC_0603@1]
R21  24K  RESISTORRLC_0603  [RLC_0603@1]
R30  10M  RESISTORRLC_0603  [RLC_0603@1]
R31  240K  RESISTORRLC_0603  [RLC_0603@1]
R32  zerohm  RESISTORRLC_0603  [RLC_0603@1]
R33  2.4K  RESISTORRLC_0603  [RLC_0603@1]
R34  10K  RESISTORRLC_0603  [RLC_0603@1]
R35  zerohm  RESISTORRLC_0603  [RLC_0603@1]
R36  dnp  RESISTORRLC_0603  [RLC_0603@1]
R37  dnp  RESISTORRLC_0603  [RLC_0603@1]
R38  dnp  RESISTORRLC_0603  [RLC_0603@1]
R40  10K  RESISTORRLC_0603  [RLC_0603@1]
R41  10M  RESISTORRLC_0603  [RLC_0603@1]
R42  1M  RESISTORRLC_0603  [RLC_0603@1]
R48  dnp  RESISTORRLC_0603  [RLC_0603@1]
R49  2.4K  RESISTORRLC_0603  [RLC_0603@1]
R50  10K  RESISTORRLC_0603  [RLC_0603@1]
R51  2.4K  RESISTORRLC_0603  [RLC_0603@1]
RLY1  G6S-2H  [G6S-2F]
TP1  TESTPAD  [SMD-TESTPOINT]

### Nets
A_RLY_NC: C14.1 R21.1 RLY1.3(A:NC)
A_RLY_NO: C42.1 RLY1.5(A:NO)
ADC_IN: IC11.2(B1) IC11.3(B2) IC11.9(B3) IC11.10(B4) TP1.1 ; also sheet 4
ADCDR_HI: C17.2 IC6.8(C:OUT) IC11.11(A4) R18.2
ADCDR_LO: C13.2 IC6.7(B:OUT) IC11.4(A2) R14.2
AMPL_HI: R41.2 R42.2 ; also sheet 3
AMPL_LO: R30.2 R31.2 ; also sheet 3
ANT_HI: RLY1.4(A:COM) ; also sheet 6
ANT_LO: RLY1.9(B:COM) ; also sheet 6
B_RLY_NC: D1.1(A) R20.1 RLY1.10(B:NC)
B_RLY_NO: C43.1 RLY1.8(B:NO)
CROSS_HI: IC5.6(B:OUT) ; also sheet 4
CROSS_LO: IC5.7(A:OUT) ; also sheet 4
GND [power]: C10.2 C11.2 C15.2 C45.2 D3.1(A) D10.1(A) D11.1(A) IC5.2(A:-IN) IC5.4(B:-IN) IC5.5(P:V-) IC6.11(P:V-) IC6.12(D:+IN) IC6.13(D:-IN) IC11.7(VSS) IC14.4(P:V-) Q1.2(E) R10.1 R11.1 R15.1 R31.1 R42.1 ; also sheet 1,2,3,4,6,7,8
MUXSEL_HIPKD: IC11.12(C4) ; also sheet 3
MUXSEL_HIRAW: IC11.6(C3) ; also sheet 3
MUXSEL_LOPKD: IC11.5(C2) ; also sheet 3
MUXSEL_LORAW: IC11.13(C1) ; also sheet 3
N$14: IC6.3(A:+IN) R9.1 R10.2
N$15: C17.1 IC6.9(C:-IN) R18.1 R19.2
N$16: C12.2 IC6.5(B:+IN) R12.2
N$17: C13.1 IC6.6(B:-IN) R13.2 R14.1
N$18: C16.1 R16.2
N$19: C11.1 C12.1 D1.3(C) D11.3(C) R11.2 R30.1
N$20: C14.2 D2.1(A) D3.3(C)
N$21: C15.1 D2.3(C) D10.3(C) R15.2 R16.1 R41.1
N$22: C16.2 IC6.10(C:+IN) R17.2 R36.2 R37.2
N$23: IC5.1(A:+IN) R20.2
N$26: IC5.3(B:+IN) R21.2
N$35: D7.1(A) Q1.3(C) RLY1.12
N$38: Q1.1(B) R40.2
N$43: C41.2 IC11.1(A1) IC14.7(B:OUT) R34.2
N$47: IC14.3(A:+IN) R35.2 R49.2
N$50: C43.2 R32.1
N$51: C42.2 R35.1
N$52: C40.1 IC14.2(A:-IN) R33.1 R51.2
N$53: C41.1 IC14.6(B:-IN) R34.1 R50.2
N$54: IC14.5(B:+IN) R32.2 R48.2
N$56: R37.1 R38.2
RAW_HI: C40.2 IC11.8(A3) IC14.1(A:OUT) R33.2
RELAY_ON: R40.1 ; also sheet 3
VDD [power]: D7.3(C) IC5.8(P:V+) IC6.4(P:V+) IC11.14(VDD) IC14.8(P:V+) R9.2 RLY1.1 ; also sheet 1,2,4,6
VMID: C10.1 C45.1 IC6.1(A:OUT) IC6.2(A:-IN) R12.1 R13.1 R17.1 R19.1 R36.1 R38.1 R48.1 R49.1 R50.1 R51.1 ; supply symbol labelled SUPPLY_VMID
Unconnected: IC6.14(D:OUT)

### Notes on the sheet
- D2, D3 are BAR18
- analog rx path

## Sheet 6 of 8
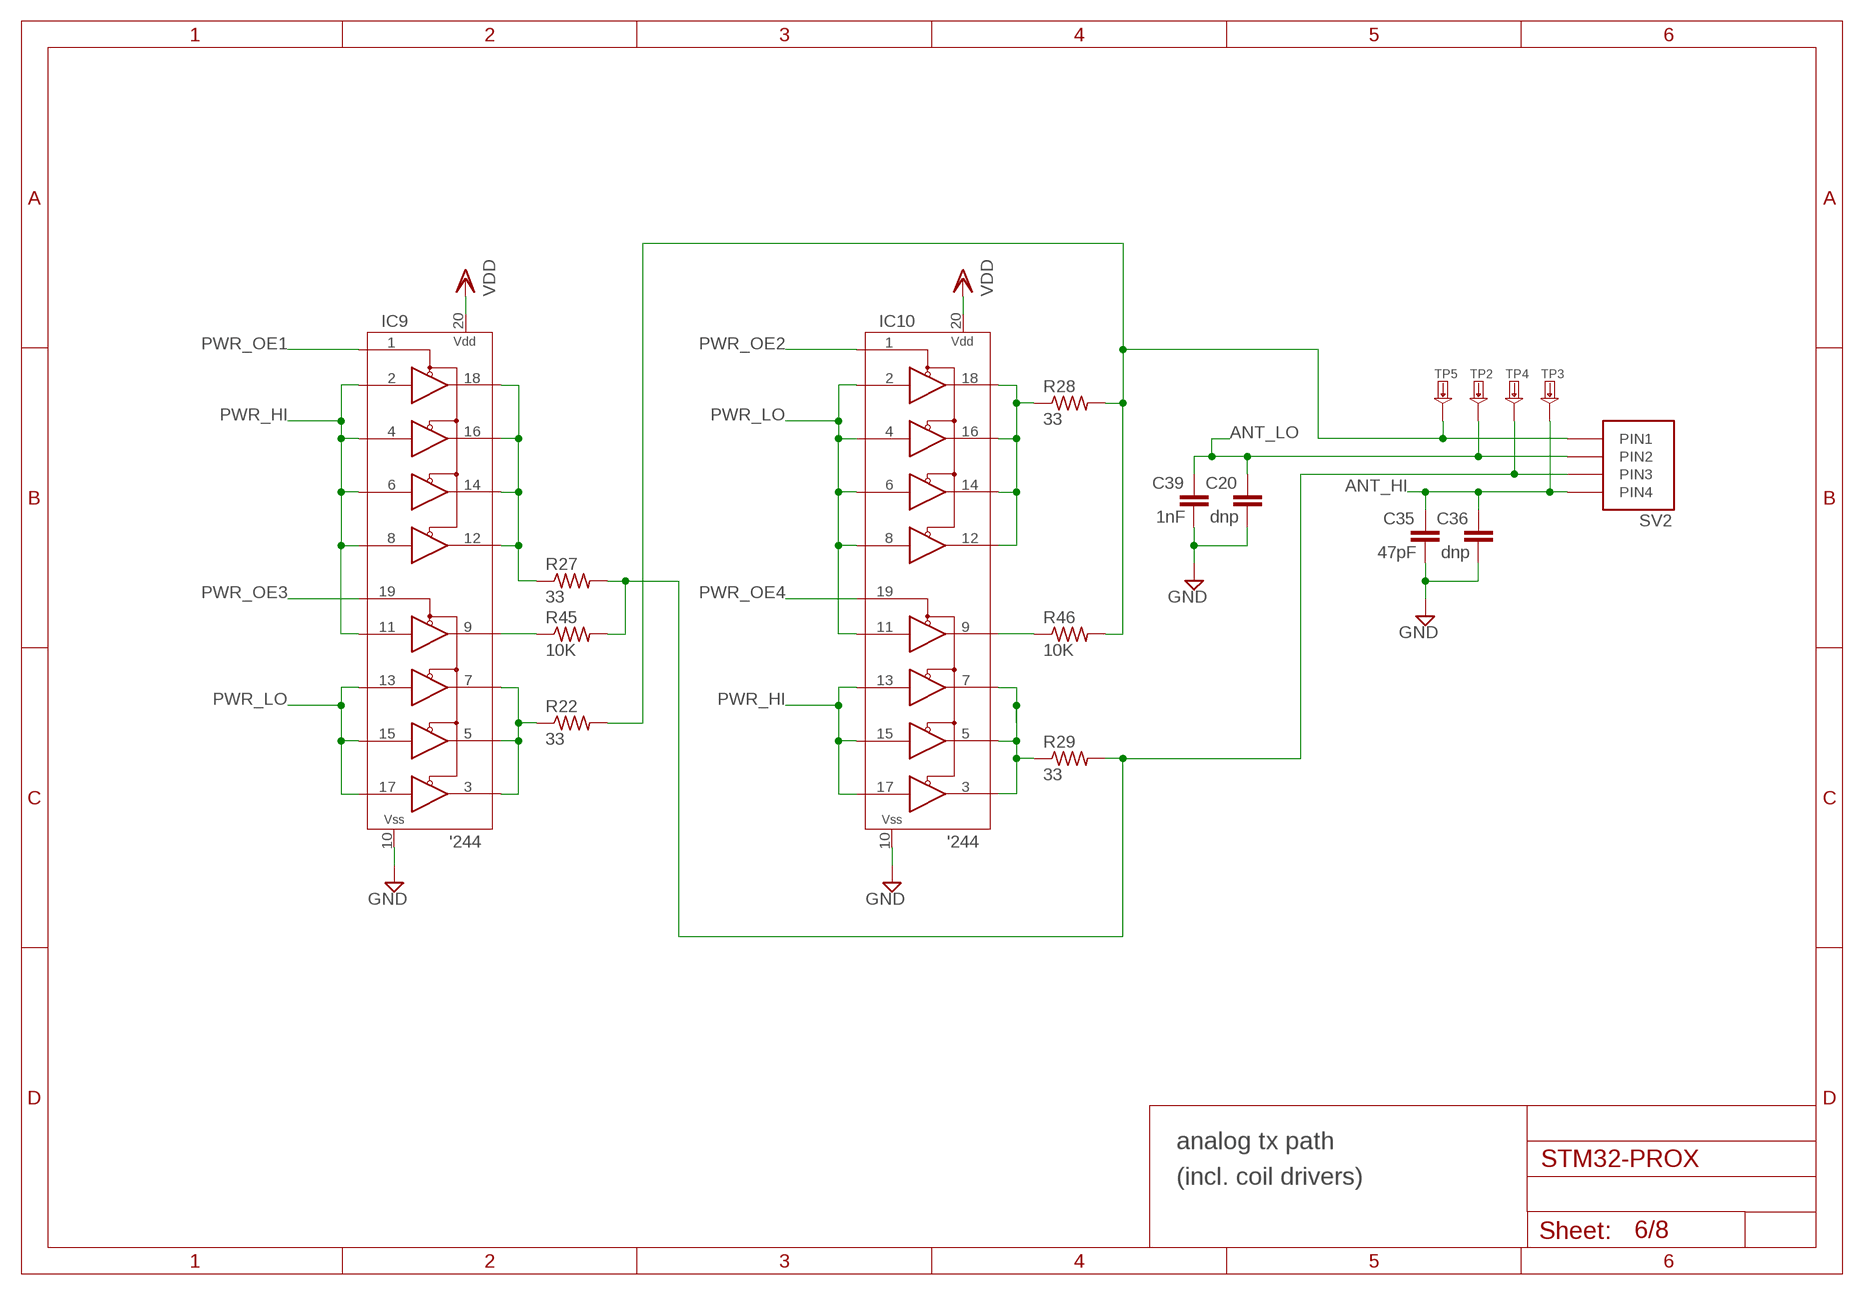
[diagram p5: schematic, sheet 6]

### Parts
C20  dnp  CAPACITORRLC_0603  [RLC_0603]
C35  47pF  CAPACITORRLC_0603  [RLC_0603]
C36  dnp  CAPACITORRLC_0603  [RLC_0603]
C39  1nF  CAPACITORRLC_0603  [RLC_0603]
IC9  74XX244  74XX244-OCTAL-TRISTATE-BUFFERS  [TSSOP-20]
IC10  74XX244  74XX244-OCTAL-TRISTATE-BUFFERS  [TSSOP-20]
R22  33  RESISTORRLC_0603  [RLC_0603@1]
R27  33  RESISTORRLC_0603  [RLC_0603@1]
R28  33  RESISTORRLC_0603  [RLC_0603@1]
R29  33  RESISTORRLC_0603  [RLC_0603@1]
R45  10K  RESISTORRLC_0603  [RLC_0603@1]
R46  10K  RESISTORRLC_0603  [RLC_0603@1]
SV2  HIROSE-MQ172-4POS  [HIROSE-MQ172-4POS]
TP2  TESTPADKEYSTONE-SMD  [KEYSTONE-SMD-TESTPOINT-5015]
TP3  TESTPADKEYSTONE-SMD  [KEYSTONE-SMD-TESTPOINT-5015]
TP4  TESTPADKEYSTONE-SMD  [KEYSTONE-SMD-TESTPOINT-5015]
TP5  TESTPADKEYSTONE-SMD  [KEYSTONE-SMD-TESTPOINT-5015]

### Nets
ANT_HI: C35.1 C36.1 SV2.4(PIN4) TP3.1 ; also sheet 5
ANT_LO: C20.1 C39.1 SV2.2(PIN2) TP2.1 ; also sheet 5
GND [power]: C20.2 C35.2 C36.2 C39.2 IC9.10(VSS) IC10.10(VSS) ; also sheet 1,2,3,4,5,7,8
N$31: R27.2 R29.2 R45.2 SV2.3(PIN3) TP4.1
N$32: R22.2 R28.2 R46.2 SV2.1(PIN1) TP5.1
N$33: IC9.12(1Y4) IC9.14(1Y3) IC9.16(1Y2) IC9.18(1Y1) R27.1
N$34: IC10.12(1Y4) IC10.14(1Y3) IC10.16(1Y2) IC10.18(1Y1) R28.1
N$41: IC9.3(2Y4) IC9.5(2Y3) IC9.7(2Y2) R22.1
N$42: IC10.3(2Y4) IC10.5(2Y3) IC10.7(2Y2) R29.1
N$44: IC9.9(2Y1) R45.1
N$45: IC10.9(2Y1) R46.1
PWR_HI: IC9.2(1A1) IC9.4(1A2) IC9.6(1A3) IC9.8(1A4) IC9.11(2A1) IC10.13(2A2) IC10.15(2A3) IC10.17(2A4) ; also sheet 4
PWR_LO: IC9.13(2A2) IC9.15(2A3) IC9.17(2A4) IC10.2(1A1) IC10.4(1A2) IC10.6(1A3) IC10.8(1A4) IC10.11(2A1) ; also sheet 4
PWR_OE1: IC9.1(1NOE) ; also sheet 4
PWR_OE2: IC10.1(1NOE) ; also sheet 4
PWR_OE3: IC9.19(2NOE) ; also sheet 4
PWR_OE4: IC10.19(2NOE) ; also sheet 4
VDD [power]: IC9.20(VDD) IC10.20(VDD) ; also sheet 1,2,4,5

### Notes on the sheet
- analog tx path
- (incl. coil drivers)

## Sheet 7 of 8
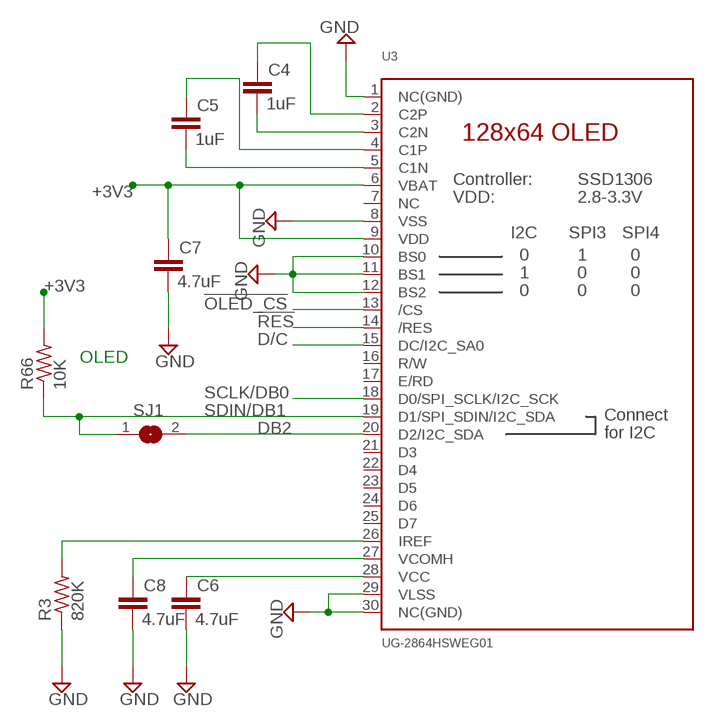
[diagram p6: schematic, sheet 7]

### Parts
C4  1uF  CAPACITORRLC_0603  [RLC_0603]
C5  1uF  CAPACITORRLC_0603  [RLC_0603]
C6  4.7uF  CAPACITORRLC_0603  [RLC_0603]
C7  4.7uF  CAPACITORRLC_0603  [RLC_0603]
C8  4.7uF  CAPACITORRLC_0603  [RLC_0603]
R3  820K  RESISTORRLC_0603  [RLC_0603@1]
R66  10K  RESISTORRLC_0603  [RLC_0603@1]
SJ1  SOLDERJUMPERREFLOW  [SOLDERJUMPER_REFLOW]
U3  UG-2864HSWEG01  MICROBUILDER_DISP_OLED_UG-2864HSWEG010.96"  [MICROBUILDER_UG-2864HSWEG01_0.96IN_WRAPAROUND]

### Nets
!OLED_CS: U3.13(/CS) ; also sheet 3
!RES: U3.14(/RES) ; also sheet 3
+3V3 [power]: C7.1 R66.2 U3.6(VBAT) U3.9(VDD) ; also sheet 2,3,4,8
D/C: U3.15(DC/I2C_SA0) ; also sheet 3
DB2: SJ1.2 U3.20(D2/I2C_SDA)
GND [power]: C6.2 C7.2 C8.2 R3.1 U3.1(NC(GND)) U3.8(VSS) U3.10(BS0) U3.11(BS1) U3.12(BS2) U3.29(VLSS) U3.30(NC(GND)) ; also sheet 1,2,3,4,5,6,8
N$5: C4.1 U3.2(C2P)
N$9: C4.2 U3.3(C2N)
N$10: C5.1 U3.4(C1P)
N$11: C5.2 U3.5(C1N)
N$13: C8.1 U3.27(VCOMH)
N$25: C6.1 U3.28(VCC)
N$28: R3.2 U3.26(IREF)
SCLK/DB0: U3.18(D0/SPI_SCLK/I2C_SCK) ; also sheet 3
SDIN/DB1: R66.1 SJ1.1 U3.19(D1/SPI_SDIN/I2C_SDA) ; also sheet 3
Unconnected: U3.7(NC) U3.16(R/W) U3.17(E/RD) U3.21(D3) U3.22(D4) U3.23(D5) U3.24(D6) U3.25(D7)

### Notes on the sheet
- OLED

## Sheet 8 of 8
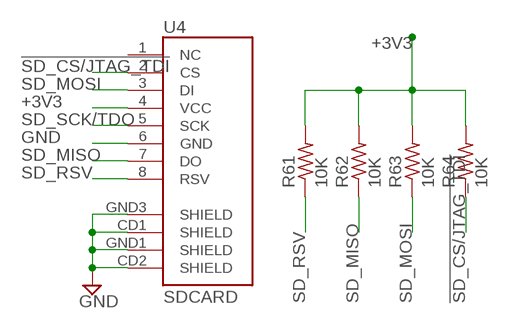
[diagram p7: schematic, sheet 8]

### Parts
R61  10K  RESISTORRLC_0603  [RLC_0603@1]
R62  10K  RESISTORRLC_0603  [RLC_0603@1]
R63  10K  RESISTORRLC_0603  [RLC_0603@1]
R64  10K  RESISTORRLC_0603  [RLC_0603@1]
U4  SDCARD  USD-SOCKETNEW  [MICRO-SD-SOCKET-PP]

### Nets
!SD_CS/JTAG_TDI: R64.1 U4.2(CS) ; also sheet 3
+3V3 [power]: R61.2 R62.2 R63.2 R64.2 U4.4(VCC) ; also sheet 2,3,4,7
GND [power]: U4.6(GND) U4.CD1(SHIELD) U4.CD2(SHIELD) U4.GND1(SHIELD) U4.GND3(SHIELD) ; also sheet 1,2,3,4,5,6,7
SD_MISO: R62.1 U4.7(DO) ; also sheet 3
SD_MOSI: R63.1 U4.3(DI) ; also sheet 3
SD_RSV: R61.1 U4.8(RSV)
SD_SCK/TDO: U4.5(SCK) ; also sheet 3
Unconnected: U4.1(NC)

## Power pins joined to a net without a drawn wire
GND: IC1.P0(GND:GND) IC1.P1(GND:GND) IC1.P2(GND:GND) IC1.P3(GND:GND) IC1.P4(GND:GND) IC1.V0(GND:GND) IC1.V1(GND:GND)

## Library data of the parts
ADC_CLK_TP ADC_NOE_TP CROSS_HI_TP CROSS_LO_TP DBG_TP OE1_TP OE2_TP OE3_TP OE4_TP PCK0_TP PWR_HI_TP PWR_LO_TP SPARE_FPGA_TP TP1-TP5 = STM32-PROX:TESTPAD; OC_NEWARK: unknown; PARTNO: *
BAT1 = STM32-PROX:NSL_SPARKFUN_BATTERY: Battery Holders Various common sizes : AA, AAA, 20mm coin cell and 12mm coin cell.; DIGIKEY: BK-885CT-ND; MPN: BK-885-TR; OC_NEWARK: unknown; PARTNO: BK-885-TR
BUZ1 = STM32-PROX:BUZZER: Piezo Buzzer Digikey part: 102-1265-1-ND; DIGIKEY: 102-1265-1-ND; MF: CCV-084B16; MPN: CCV-084B16; OC_NEWARK: unknown; PARTNO: CCV-084B16
C1 C18 C19 C21-C26 C28-C32 C44 C46 C47 C65-C67 C71 C72 C74 C75 = STM32-PROX:CAPACITOR; DIGIKEY: 311-1429-1-ND; MPN: CC0603KRX7R9BB333; OC_NEWARK: unknown; PARTNO: CC0603KRX7R9BB333
C2 C3 C14 = STM32-PROX:CAPACITOR; DIGIKEY: 445-1273-1-ND; MPN: C1608C0G1H220J080AA; OC_NEWARK: unknown; PARTNO: C1608C0G1H220J080AA
C4 C5 = STM32-PROX:CAPACITOR; DIGIKEY: 311-1358-1-ND; MPN: CC0805ZRY5V8BB105; OC_NEWARK: unknown; PARTNO: CC0805ZRY5V8BB105
C6-C8 = STM32-PROX:CAPACITOR; DIGIKEY: 1276-1065-1-ND; MPN: CL21A475KOFNNNE; OC_NEWARK: unknown; PARTNO: CL21A475KOFNNNE
C9 C48-C52 C56 = STM32-PROX:CAPACITOR; DIGIKEY: 1276-1007-1-ND; MPN: CL21F104ZBCNNNC; OC_NEWARK: unknown; PARTNO: CL21F104ZBCNNNC
C10 C45 C209-C212 = STM32-PROX:CAPACITOR; DIGIKEY: 1276-1005-1-ND; MPN: CL10B104KO8NNNC; OC_NEWARK: unknown; PARTNO: CL10B104KO8NNNC
C11 C12 C16 C39 C42 C43 = STM32-PROX:CAPACITOR; DIGIKEY: 490-1494-2-ND; MPN: GRM188R71H102KA01D; OC_NEWARK: unknown; PARTNO: GRM188R71H102KA01D
C13 C17 C20 C36 C40 C41 = STM32-PROX:CAPACITOR; OC_NEWARK: unknown; PARTNO: *
C15 = STM32-PROX:CAPACITOR; DIGIKEY: 490-1430-1-ND; MPN: GRM1885C1H131JA01D; OC_NEWARK: unknown; PARTNO: GRM1885C1H131JA01D
C27 C33 C34 = STM32-PROX:CAPACITOR; DIGIKEY: 1276-1856-1-ND; MPN: CL32B475KOINNNE; OC_NEWARK: unknown; PARTNO: CL32B475KOINNNE
C35 = STM32-PROX:CAPACITOR; DIGIKEY: 1276-1037-1-ND; MPN: CL10C470JB8NNNC; OC_NEWARK: unknown; PARTNO: CL10C470JB8NNNC
C37 C38 = STM32-PROX:CPOL-US: POLARIZED CAPACITOR, American symbol; DIGIKEY: 399-3769-1-ND; MPN: T491D107K010AT; OC_NEWARK: unknown; PARTNO: T491D107K010AT
C53 C54 = STM32-PROX:CAPACITOR; DIGIKEY: 1276-1120-1-ND; MPN: CL21C120JBANNNC; OC_NEWARK: unknown; PARTNO: CL21C120JBANNNC
C55 = STM32-PROX:CAP_POL: Capacitor Polarized These are standard SMD and PTH capacitors. Normally 10uF, 47uF, and 100uF in electrolytic and tantalum varieties. Always verify the external diameter of the through hole cap, it varies with capacity, voltage, and manufacturer. The EIA devices should be standard.; DIGIKEY: 478-1656-1-ND; MF: TAJA106M006RNJ; MPN: TAJA106M006RNJ; OC_NEWARK: unknown; PARTNO: TAJA106M006RNJ
C57 C58 C60 C63 C76 = STM32-PROX:CAPACITOR; DIGIKEY: 1276-1005-1-ND; MPN: CL10B104KO8NNNC; OC_NEWARK: 85K9474; PARTNO: CL10B104KO8NNNC
C59 C61 = STM32-PROX:CAPACITOR; DIGIKEY: 311-1372-1-ND; MPN: CC0603ZRY5V7BB105; OC_NEWARK: 06R5073; PARTNO: CC0603ZRY5V7BB105
C62 C64 = STM32-PROX:CAPACITOR; DIGIKEY: 445-9065-1-ND; DIGIKEY_ALT: 587-3238-1-ND; MPN: C1608X5R1C106M080AB; OC_NEWARK: unknown; PARTNO: C1608X5R1C106M080AB
C68-C70 C73 = microbuilder:CAP_TANTALUM: Tantalum Capacitors Wave footprints have larger pads and are meant to be used for hand soldering. Reflow footprints are optimised for solder paste and a reflow oven. EIA3216-18/A-[R/W] - Size A / 3216-18 / 1206 footprint 4.7µF 25V 10% Tantalum Capacitor 10µF 16V 10% Tantalum Capacitor [Digikey: 495-2236-2-ND] EIA3528-21/B-[R/W] - Size B / 3528-21 47µF 10V 10% Tantalum Capactior [Digikey: 495-2216-1-ND] EIA6032-28/C-[R/W] - Size C / 6032-28 10µF 35V 20% Tantalum Capacitor [Digikey: 495-2285-1-ND] 100µF 16V 10% Tantalum Capactior [Digikey: 399-5214-1-ND]
C206 = STM32-PROX:CAPACITOR; DIGIKEY: 1276-1784-1-ND; MPN: EMK107ABJ475KA-T; OC_NEWARK: unknown; PARTNO: EMK107ABJ475KA-T
D1-D3 = STM32-PROX:DIODE-SMD-SOT23; DIGIKEY: BAS21INCT-ND; MF: BAS 21 E6327; MPN: BAS 21 E6327; OC_NEWARK: unknown; PARTNO: BAS 21 E6327
D4 D5 = STM32-PROX:DIODE: Diode These are standard reverse protection diodes and small signal diodes. SMA package can handle up to about 1A. SOD-323 can handle about 200mA. What the SOD-323 package when ordering, there are some mfgs out there that are 5-pin packages.; DIGIKEY: 568-4134-1-ND; MPN: PMEG4005ET,215; OC_NEWARK: unknown; PARTNO: PMEG4005ET,215
D6 = badge.lbrbadge_2013:USBUG_PRTR5V0U2X: Ultra low capacitance double rail-to-rail ESD protection diode
D7 = STM32-PROX:DIODE-SMD-SOT23; DIGIKEY: BZX84C47-FDICT-ND; OC_NEWARK: unknown; PARTNO: *
D10 D11 = STM32-PROX:DIODE-SMD-SOT23; OC_NEWARK: unknown; PARTNO: *
F1 = STM32-PROX:PTCFUSE: PTC fuses, resettable thermistors; DIGIKEY: MICROSMD050FCT-ND; MPN: MICROSMD050F-2; OC_NEWARK: unknown; PARTNO: MICROSMD050F-2
FB1 FB2\ FB3 = STM32-PROX:FERRITE; DIGIKEY: 490-1057-6-ND; PARTNO: BLM31PG601SN1L
FPGA_DOUT_TP FPGA_NINIT_TP FPGA_NINIT_TP1 FPGA_NINIT_TP2 LED_A_TP MISO_TP MOSI_TP NCS_TP RELAY_ON_TP SPCK_TP TP6 TP11 TP16 TP18-TP20 TP22-TP26 TP28-TP35 TP48-TP55 = STM32-PROX:TESTPAD
IC1 = STM32-PROX:IC_TPS6120X: Low input voltage Synchronous Boost converter; DIGIKEY: 296-21685-1-ND; MPN: TPS61202DRCT; OC_NEWARK: unknown; PARTNO: TPS61202DRCT
IC2 = STM32-PROX:STM32F1_HIGH_DENSITY_LQFP64: STM32F1_High_density_LQFP64 edit this description Auto generated by make-symbol-device-package-bsdl.ulp Rev. 43 Source: STM32F1_High_density_LQFP64.bsd
IC3 = STM32-PROX:PQ1X331M2ZP-3V3-LDO-SOT-23-5; DIGIKEY: 296-18476-1-ND; MPN: LP2985-33DBVR; OC_NEWARK: unknown; PARTNO: LP2985-33DBVR
IC4 = STM32-PROX:HCU-INVERTER; DIGIKEY: NC7SZ04M5XCT-ND; MF: NC7SZ04M5X; OC_NEWARK: unknown; PARTNO: *
IC5 = STM32-PROX:COMP-TLV3502; DIGIKEY: 296-18147-1-ND; MPN: TLV3502AIDCNT; OC_NEWARK: unknown; PARTNO: TLV3502AIDCNT
IC6 = STM32-PROX:OPAMP-TLC2274; DIGIKEY: MCP6294-E/ST-ND; MPN: MCP6294-E/ST; OC_NEWARK: unknown; PARTNO: MCP6294-E/ST
IC7 = STM32-PROX:MCP100; DIGIKEY: MCP100T-270I/TTCT-ND; MPN: MCP100T-270I/TT; OC_NEWARK: unknown; PARTNO: MCP100T-270I/TT
IC8 = STM32-PROX:TLC5540; DIGIKEY: 296-2184-5-ND; MPN: TLC5540IPW; OC_NEWARK: unknown; PARTNO: TLC5540IPW
IC9 IC10 = STM32-PROX:74XX244-OCTAL-TRISTATE-BUFFERS; DIGIKEY: 497-2913-1-ND; MF: 74AC244TTR; MPN: 74AC244TTR; OC_NEWARK: unknown; PARTNO: 74AC244TTR
IC11 = STM32-PROX:CD4066; DIGIKEY: 296-14123-1-ND; MPN: CD4066BPWR; OC_NEWARK: unknown; PARTNO: CD4066BPWR
IC13 = STM32-PROX:PQ1X331M2ZP-3V3-LDO-SOT-23-5; DIGIKEY: 296-18476-2-ND; MPN: LP2985-33DBVR; OC_NEWARK: unknown; PARTNO: LP2985-33DBVR
IC14 = STM32-PROX:OPAMP-AD8052; DIGIKEY: AD8052ARMZ-ND; MPN: AD8052ARMZ; OC_NEWARK: unknown; PARTNO: AD8052ARMZ
IC105 = STM32-PROX:TPS799*: IC LDO REG 200mA Digikey part: 296-17782-1-ND; DIGIKEY: MCP1824T-2502E/OTCT-ND; MPN: MCP1824T-2502E/OT; OC_NEWARK: unknown; PARTNO: MCP1824T-2502E/OT
IC106 = STM32-PROX:TPS799*: IC LDO REG 200mA Digikey part: 296-17782-1-ND; DIGIKEY: MCP1824T-1202E/OTCT-ND; MPN: MCP1824T-1202E/OT; OC_NEWARK: unknown; PARTNO: MCP1824T-1202E/OT
JP2 = STM32-PROX:JUMPER-3; MPN: NONE; OC_NEWARK: unknown; PARTNO: NONE
JP4 = microbuilder:HEADER-1X7: PIN HEADER
JP_AH JP_AL = STM32-PROX:JUMPER-3
K1-K3 = STM32-PROX:5-XX; DIGIKEY: CKN9102-ND; MF: PTS635SL50 LFS; MPN: PTS635SL50 LFS; OC_NEWARK: unknown; PARTNO: PTS635SL50 LFS
L1 = STM32-PROX:FERRITE1: Ferrite Bead 0603 120 Ohm, 600mA Ferrite Chip - Digikey: 445-2164-1-ND; MPN: NONE; OC_NEWARK: unknown; PARTNO: NONE
L2 = STM32-PROX:CDRH2D18; OC_NEWARK: unknown; PARTNO: *
LED1 = STM32-PROX:LED_LED: LED OSRAM: - CHIPLED LG R971, LG N971, LY N971, LG Q971, LY Q971, LO R971, LY R971 LH N974, LH R974 LS Q976, LO Q976, LY Q976 LO Q996 - Hyper CHIPLED LW Q18S LB Q993, LB Q99A, LB R99A - SideLED LS A670, LO A670, LY A670, LG A670, LP A670 LB A673, LV A673, LT A673, LW A673 LH A674 LY A675 LS A676, LA A676, LO A676, LY A676, LW A676 LS A679, LY A679, LG A679 - Hyper Micro SIDELED® LS Y876, LA Y876, LO Y876, LY Y876 LT Y87S - SmartLED LW L88C, LW L88S LB L89C, LB L89S, LG L890 LS L89K, LO L89K, LY L89K LS L896, LA L896, LO L896, LY L896 - TOPLED LS T670, LO T670, LY T670, LG T670, LP T670 LSG T670, LSP T670, LSY T670, LOP T670, LYG T670 LG T671, LOG T671, LSG T671 LB T673, LV T673, LT T673, LW T673 LH T674 LS T676, LA T676, LO T676, LY T676, LB T676, LH T676, LSB T676, LW T676 LB T67C, LV T67C, LT T67C, LS T67K, LO T67K, LY T67K, LW E67C LS E67B, LA E67B, LO E67B, LY E67B, LB E67C, LV E67C, LT E67C LW T67C LS T679, LY T679, LG T679 LS T770, LO T770, LY T770, LG T770, LP T770 LB T773, LV T773, LT T773, LW T773 LH T774 LS E675, LA E675, LY E675, LS T675 LS T776, LA T776, LO T776, LY T776, LB T776 LHGB T686 LT T68C, LB T68C - Hyper Mini TOPLED® LB M676 - Mini TOPLED Santana® LG M470 LS M47K, LO M47K, LY M47K Source: http://www.osram.convergy.de LUXEON: - LUMILED® LXK2-PW12-R00, LXK2-PW12-S00, LXK2-PW14-U00, LXK2-PW14-V00 LXK2-PM12-R00, LXK2-PM12-S00, LXK2-PM14-U00 LXK2-PE12-Q00, LXK2-PE12-R00, LXK2-PE12-S00, LXK2-PE14-T00, LXK2-PE14-U00 LXK2-PB12-K00, LXK2-PB12-L00, LXK2-PB12-M00, LXK2-PB14-N00, LXK2-PB14-P00, LXK2-PB14-Q00 LXK2-PR12-L00, LXK2-PR12-M00, LXK2-PR14-Q00, LXK2-PR14-R00 LXK2-PD12-Q00, LXK2-PD12-R00, LXK2-PD12-S00 LXK2-PH12-R00, LXK2-PH12-S00 LXK2-PL12-P00, LXK2-PL12-Q00, LXK2-PL12-R00 Source: www.luxeon.com KINGBRIGHT: KA-3528ASYC Source: www.kingbright.com; DIGIKEY: 475-1409-1-ND; MF: LG Q971-KN-1; OC_NEWARK: unknown; PARTNO: *
LED2 = STM32-PROX:LED_LED: LED OSRAM: - CHIPLED LG R971, LG N971, LY N971, LG Q971, LY Q971, LO R971, LY R971 LH N974, LH R974 LS Q976, LO Q976, LY Q976 LO Q996 - Hyper CHIPLED LW Q18S LB Q993, LB Q99A, LB R99A - SideLED LS A670, LO A670, LY A670, LG A670, LP A670 LB A673, LV A673, LT A673, LW A673 LH A674 LY A675 LS A676, LA A676, LO A676, LY A676, LW A676 LS A679, LY A679, LG A679 - Hyper Micro SIDELED® LS Y876, LA Y876, LO Y876, LY Y876 LT Y87S - SmartLED LW L88C, LW L88S LB L89C, LB L89S, LG L890 LS L89K, LO L89K, LY L89K LS L896, LA L896, LO L896, LY L896 - TOPLED LS T670, LO T670, LY T670, LG T670, LP T670 LSG T670, LSP T670, LSY T670, LOP T670, LYG T670 LG T671, LOG T671, LSG T671 LB T673, LV T673, LT T673, LW T673 LH T674 LS T676, LA T676, LO T676, LY T676, LB T676, LH T676, LSB T676, LW T676 LB T67C, LV T67C, LT T67C, LS T67K, LO T67K, LY T67K, LW E67C LS E67B, LA E67B, LO E67B, LY E67B, LB E67C, LV E67C, LT E67C LW T67C LS T679, LY T679, LG T679 LS T770, LO T770, LY T770, LG T770, LP T770 LB T773, LV T773, LT T773, LW T773 LH T774 LS E675, LA E675, LY E675, LS T675 LS T776, LA T776, LO T776, LY T776, LB T776 LHGB T686 LT T68C, LB T68C - Hyper Mini TOPLED® LB M676 - Mini TOPLED Santana® LG M470 LS M47K, LO M47K, LY M47K Source: http://www.osram.convergy.de LUXEON: - LUMILED® LXK2-PW12-R00, LXK2-PW12-S00, LXK2-PW14-U00, LXK2-PW14-V00 LXK2-PM12-R00, LXK2-PM12-S00, LXK2-PM14-U00 LXK2-PE12-Q00, LXK2-PE12-R00, LXK2-PE12-S00, LXK2-PE14-T00, LXK2-PE14-U00 LXK2-PB12-K00, LXK2-PB12-L00, LXK2-PB12-M00, LXK2-PB14-N00, LXK2-PB14-P00, LXK2-PB14-Q00 LXK2-PR12-L00, LXK2-PR12-M00, LXK2-PR14-Q00, LXK2-PR14-R00 LXK2-PD12-Q00, LXK2-PD12-R00, LXK2-PD12-S00 LXK2-PH12-R00, LXK2-PH12-S00 LXK2-PL12-P00, LXK2-PL12-Q00, LXK2-PL12-R00 Source: www.luxeon.com KINGBRIGHT: KA-3528ASYC Source: www.kingbright.com; DIGIKEY: 475-3016-1-ND; MF: LS Q971-KN-1; OC_NEWARK: unknown; PARTNO: *
LED3 = STM32-PROX:LED_LED: LED OSRAM: - CHIPLED LG R971, LG N971, LY N971, LG Q971, LY Q971, LO R971, LY R971 LH N974, LH R974 LS Q976, LO Q976, LY Q976 LO Q996 - Hyper CHIPLED LW Q18S LB Q993, LB Q99A, LB R99A - SideLED LS A670, LO A670, LY A670, LG A670, LP A670 LB A673, LV A673, LT A673, LW A673 LH A674 LY A675 LS A676, LA A676, LO A676, LY A676, LW A676 LS A679, LY A679, LG A679 - Hyper Micro SIDELED® LS Y876, LA Y876, LO Y876, LY Y876 LT Y87S - SmartLED LW L88C, LW L88S LB L89C, LB L89S, LG L890 LS L89K, LO L89K, LY L89K LS L896, LA L896, LO L896, LY L896 - TOPLED LS T670, LO T670, LY T670, LG T670, LP T670 LSG T670, LSP T670, LSY T670, LOP T670, LYG T670 LG T671, LOG T671, LSG T671 LB T673, LV T673, LT T673, LW T673 LH T674 LS T676, LA T676, LO T676, LY T676, LB T676, LH T676, LSB T676, LW T676 LB T67C, LV T67C, LT T67C, LS T67K, LO T67K, LY T67K, LW E67C LS E67B, LA E67B, LO E67B, LY E67B, LB E67C, LV E67C, LT E67C LW T67C LS T679, LY T679, LG T679 LS T770, LO T770, LY T770, LG T770, LP T770 LB T773, LV T773, LT T773, LW T773 LH T774 LS E675, LA E675, LY E675, LS T675 LS T776, LA T776, LO T776, LY T776, LB T776 LHGB T686 LT T68C, LB T68C - Hyper Mini TOPLED® LB M676 - Mini TOPLED Santana® LG M470 LS M47K, LO M47K, LY M47K Source: http://www.osram.convergy.de LUXEON: - LUMILED® LXK2-PW12-R00, LXK2-PW12-S00, LXK2-PW14-U00, LXK2-PW14-V00 LXK2-PM12-R00, LXK2-PM12-S00, LXK2-PM14-U00 LXK2-PE12-Q00, LXK2-PE12-R00, LXK2-PE12-S00, LXK2-PE14-T00, LXK2-PE14-U00 LXK2-PB12-K00, LXK2-PB12-L00, LXK2-PB12-M00, LXK2-PB14-N00, LXK2-PB14-P00, LXK2-PB14-Q00 LXK2-PR12-L00, LXK2-PR12-M00, LXK2-PR14-Q00, LXK2-PR14-R00 LXK2-PD12-Q00, LXK2-PD12-R00, LXK2-PD12-S00 LXK2-PH12-R00, LXK2-PH12-S00 LXK2-PL12-P00, LXK2-PL12-Q00, LXK2-PL12-R00 Source: www.luxeon.com KINGBRIGHT: KA-3528ASYC Source: www.kingbright.com; DIGIKEY: 475-2558-1-ND; MF: LY Q976-P1S2-36; OC_NEWARK: unknown; PARTNO: *
Q1 = STM32-PROX:NPN-SOT23-2N3904; DIGIKEY: 568-1741-1-ND; MF: PMBT3904,215; MPN: PMBT3904,215; OC_NEWARK: unknown; PARTNO: PMBT3904,215
Q2 Q4 = transistor-npn:BC817*: NPN Transistor
Q3 = STM32-PROX:TRANSISTOR_NPN: Transistor NPN BJT configuration in SOT23 package. MMBT2222 is the common NPN we use. Double check BCE configuration again layout.; MPN: MMBT2222A-7-F; OC_NEWARK: unknown; PARTNO: MMBT2222A-7-F
R1 R42 = STM32-PROX:RESISTOR; DIGIKEY: 311-1.0MGRTR-ND; MPN: RC0603JR-071ML; OC_NEWARK: unknown; PARTNO: RC0603JR-071ML
R2 R52 R54 R319 = STM32-PROX:RESISTOR; DIGIKEY: RMCF0603JT100RCT-ND; MPN: RMCF0603JT100R; OC_NEWARK: unknown; PARTNO: RMCF0603JT100R
R3 R66 = STM32-PROX:RESISTOR; DIGIKEY: 311-820KGRTR-ND; MPN: RC0603JR-07820KL; OC_NEWARK: unknown; PARTNO: RC0603JR-07820KL
R4 R5 R13-R15 R17-R19 R34 R40 R45-R47 R50 R56-R58 R61-R64 R67-R71 R102 = STM32-PROX:RESISTOR; DIGIKEY: RMCF0603JT10K0CT-ND; MPN: RMCF0603JT10K0; OC_NEWARK: unknown; PARTNO: RMCF0603JT10K0
R6 = STM32-PROX:RESISTOR; DIGIKEY: RMCF0603JT390RCT-ND; MPN: RMCF0603JT390R; OC_NEWARK: unknown; PARTNO: RMCF0603JT390R
R7 R8 = STM32-PROX:RESISTOR; DIGIKEY: RMCF0603JT27R0CT-ND; MPN: RMCF0603JT27R0; OC_NEWARK: unknown; PARTNO: RMCF0603JT27R0
R9 R10 R12 = STM32-PROX:RESISTOR; DIGIKEY: 311-100KGRTR-ND; MPN: RC0603JR-07100KL; OC_NEWARK: unknown; PARTNO: RC0603JR-07100KL
R11 = STM32-PROX:RESISTOR; DIGIKEY: P510KGTR-ND; MPN: ERJ-3GEYJ514V; OC_NEWARK: unknown; PARTNO: ERJ-3GEYJ514V
R16 R24 R25 R32 R35-R38 R48 = STM32-PROX:RESISTOR; OC_NEWARK: unknown; PARTNO: *
R20 R31 = STM32-PROX:RESISTOR; DIGIKEY: 1276-5119-2-ND; MPN: RC1608J244CS; OC_NEWARK: unknown; PARTNO: RC1608J244CS
R21 = STM32-PROX:RESISTOR; DIGIKEY: 311-24KGRTR-ND; MPN: RC0603JR-0724KL; OC_NEWARK: unknown; PARTNO: RC0603JR-0724KL
R22 R27-R29 = STM32-PROX:RESISTOR; DIGIKEY: 311-33GRTR-ND; MPN: RC0603JR-0733RL; OC_NEWARK: unknown; PARTNO: RC0603JR-0733RL
R23 R39 R44 = STM32-PROX:RESISTOR; DIGIKEY: RMCF0603JT1K00CT-ND; MPN: RMCF0603JT1K00; OC_NEWARK: unknown; PARTNO: RMCF0603JT1K00
R26 = STM32-PROX:RESISTOR; DIGIKEY: 541-215KHCT-ND; MPN: CRCW0603215KFKEA; OC_NEWARK: unknown; PARTNO: CRCW0603215KFKEA
R30 R41 = STM32-PROX:RESISTOR; DIGIKEY: 311-10MGRTR-ND; MPN: RC0603JR-0710ML; OC_NEWARK: unknown; PARTNO: RC0603JR-0710ML
R33 R49 R51 = STM32-PROX:RESISTOR; DIGIKEY: 311-2.40KHRTR-ND; MPN: RC0603FR-072K4L; OC_NEWARK: unknown; PARTNO: RC0603FR-072K4L
R43 = STM32-PROX:RESISTOR; DIGIKEY: RMCF0603JT75K0CT-ND; MPN: RMCF0603JT75K0; OC_NEWARK: unknown; PARTNO: RMCF0603JT75K0
R53 R65 = STM32-PROX:RESISTOR; DIGIKEY: RMCF0603JT330RCT-ND; MPN: RMCF0603JT330R; OC_NEWARK: unknown; PARTNO: RMCF0603JT330R
R55 = STM32-PROX:RESISTOR; DIGIKEY: RHM1.5MDCT-ND; MPN: ESR03EZPJ155; OC_NEWARK: unknown; PARTNO: ESR03EZPJ155; TOLERANCE: 5%
R59 = STM32-PROX:RESISTOR; DIGIKEY: RMCF0603JT3K30CT-ND; MPN: RMCF0603JT3K30; OC_NEWARK: unknown; PARTNO: RMCF0603JT3K30
R60 = STM32-PROX:RESISTOR; DIGIKEY: RHM150KADCT-ND; MPN: ESR03EZPF1503; OC_NEWARK: unknown; PARTNO: ESR03EZPF1503; TOLERANCE: 1%
RLY1 = STM32-PROX:G6S-2H
S1 = STM32-PROX:SWITCH-SPDT: SPDT Switch Simple slide switch, Spark Fun Electronics SKU : COM-00102 DPDT SMT slide switch, AYZ0202, SWCH-08179; OC_NEWARK: unknown; PARTNO: *
SJ1 = STM32-PROX:SOLDERJUMPER: SMD Solder JUMPER Solder the two pads together to create a connection, or remove the solder to break it. REFLOW - Use this footprint for solder paste and reflow ovens. WAVE - Use this footprint for hand-soldering (larger pads).; MPN: NONE; OC_NEWARK: unknown; PARTNO: NONE
SV1 = STM32-PROX:USB-MINIB; OC_NEWARK: unknown; PARTNO: *
SV2 = STM32-PROX:HIROSE-MQ172-4POS; DIGIKEY: H10488CT-ND; MF: MQ172X-4PA(66); OC_NEWARK: unknown; PARTNO: *
SV5 = STM32-PROX:HEADER-MALE-6X1; OC_NEWARK: unknown; PARTNO: *
TP8 = STM32-PROX:TESTPAD; MPN: NONE; OC_NEWARK: unknown; PARTNO: NONE
TP9 TP10 = STM32-PROX:--MERGED_TESTPAD; MPN: NONE; OC_NEWARK: unknown; PARTNO: NONE
U1 = STM32-PROX:FERRITE; DIGIKEY: 445-1566-1-ND; MF: MPZ2012S300A; MPN: MPZ2012S300A; OC_NEWARK: unknown; PARTNO: MPZ2012S300A
U2 = STM32-PROX:XC3S50; MPN: XC3S50-5VQ100C (not on bom); OC_NEWARK: unknown; PARTNO: XC3S50-5VQ100C (not on bom)
U3 = STM32-PROX:MICROBUILDER_DISP_OLED_UG-2864HSWEG01: UG-2864HSWEG01 OLED display Both 1.3" and 0.96" models share the same FPC tab footprint, only the screen dimensions vary.; OC_NEWARK: unknown; PARTNO: *
U4 = STM32-PROX:USD-SOCKET: microSD Socket Push-push type uSD socket. Schematic element and footprint production proven. Spark Fun Electronics SKU : PRT-00127. tDoc lines correctly indicate media card edge positions when inserting (unlocked, locked, depressed).; OC_NEWARK: unknown; PARTNO: *
U$7 = STM32-PROX:MC34674; DIGIKEY: MC34674AEPR2TR-ND; MF: MC34674AEPR2; MOUSER: 841-MC34674AEPR2; MPN: MC34674AEPR2; OC_NEWARK: unknown; PARTNO: MC34674AEPR2
U$9 = STM32-PROX:BATT; DIGIKEY: MC34674AEPR2TR-ND; MF: MC34674AEPR2; MPN: MC34674AEPR2; OC_NEWARK: unknown; PARTNO: MC34674AEPR2
USB-MICRO = STM32-PROX:USB: USB Connectors USB-B-PTH is fully proven SKU : PRT-00139 USB-miniB is fully proven SKU : PRT-00587 USB-A-PCB is untested. USB-A-H is throughly reviewed, but untested. Spark Fun Electronics SKU : PRT-00437 USB-B-SMT is throughly reviewed, but untested. Needs silkscreen touching up. USB-A-S has not been used/tested USB-MB-H has not been used/tested; DIGIKEY: A97800CT-ND; MF: 1981568-1; MPN: 1981568-1; OC_NEWARK: unknown; PARTNO: 1981568-1
XT1 = STM32-PROX:XTAL-SMD-CITIZEN-CS10; DIGIKEY: 535-9101-1-ND; MF: ABM3-13.560MHZ-B2-T; MPN: ABM3-13.560MHZ-B2-T; OC_NEWARK: unknown; PARTNO: ABM3-13.560MHZ-B2-T
Y1 = STM32-PROX:CRYSTAL: Various standard crystals. Proven footprints. Spark Fun Electronics SKU : COM-00534; DIGIKEY: 887-1740-1-ND; MPN: 7A-8.000MAAE-T; OC_NEWARK: unknown; PARTDB: 7A-8.000MAAE-T; PARTNO: 7A-8.000MAAE-T

## Net classes
0 default: width 0.203 mm
1 adc: width 0.203 mm
2 power: width 0.279 mm, drill 0.254 mm